# EAGLE schematic evcu_v_0-2 (EAGLE 6.5.0)
DATABASE: ./eVCU_PARTSDB.csv

## Sheet 1 of 9
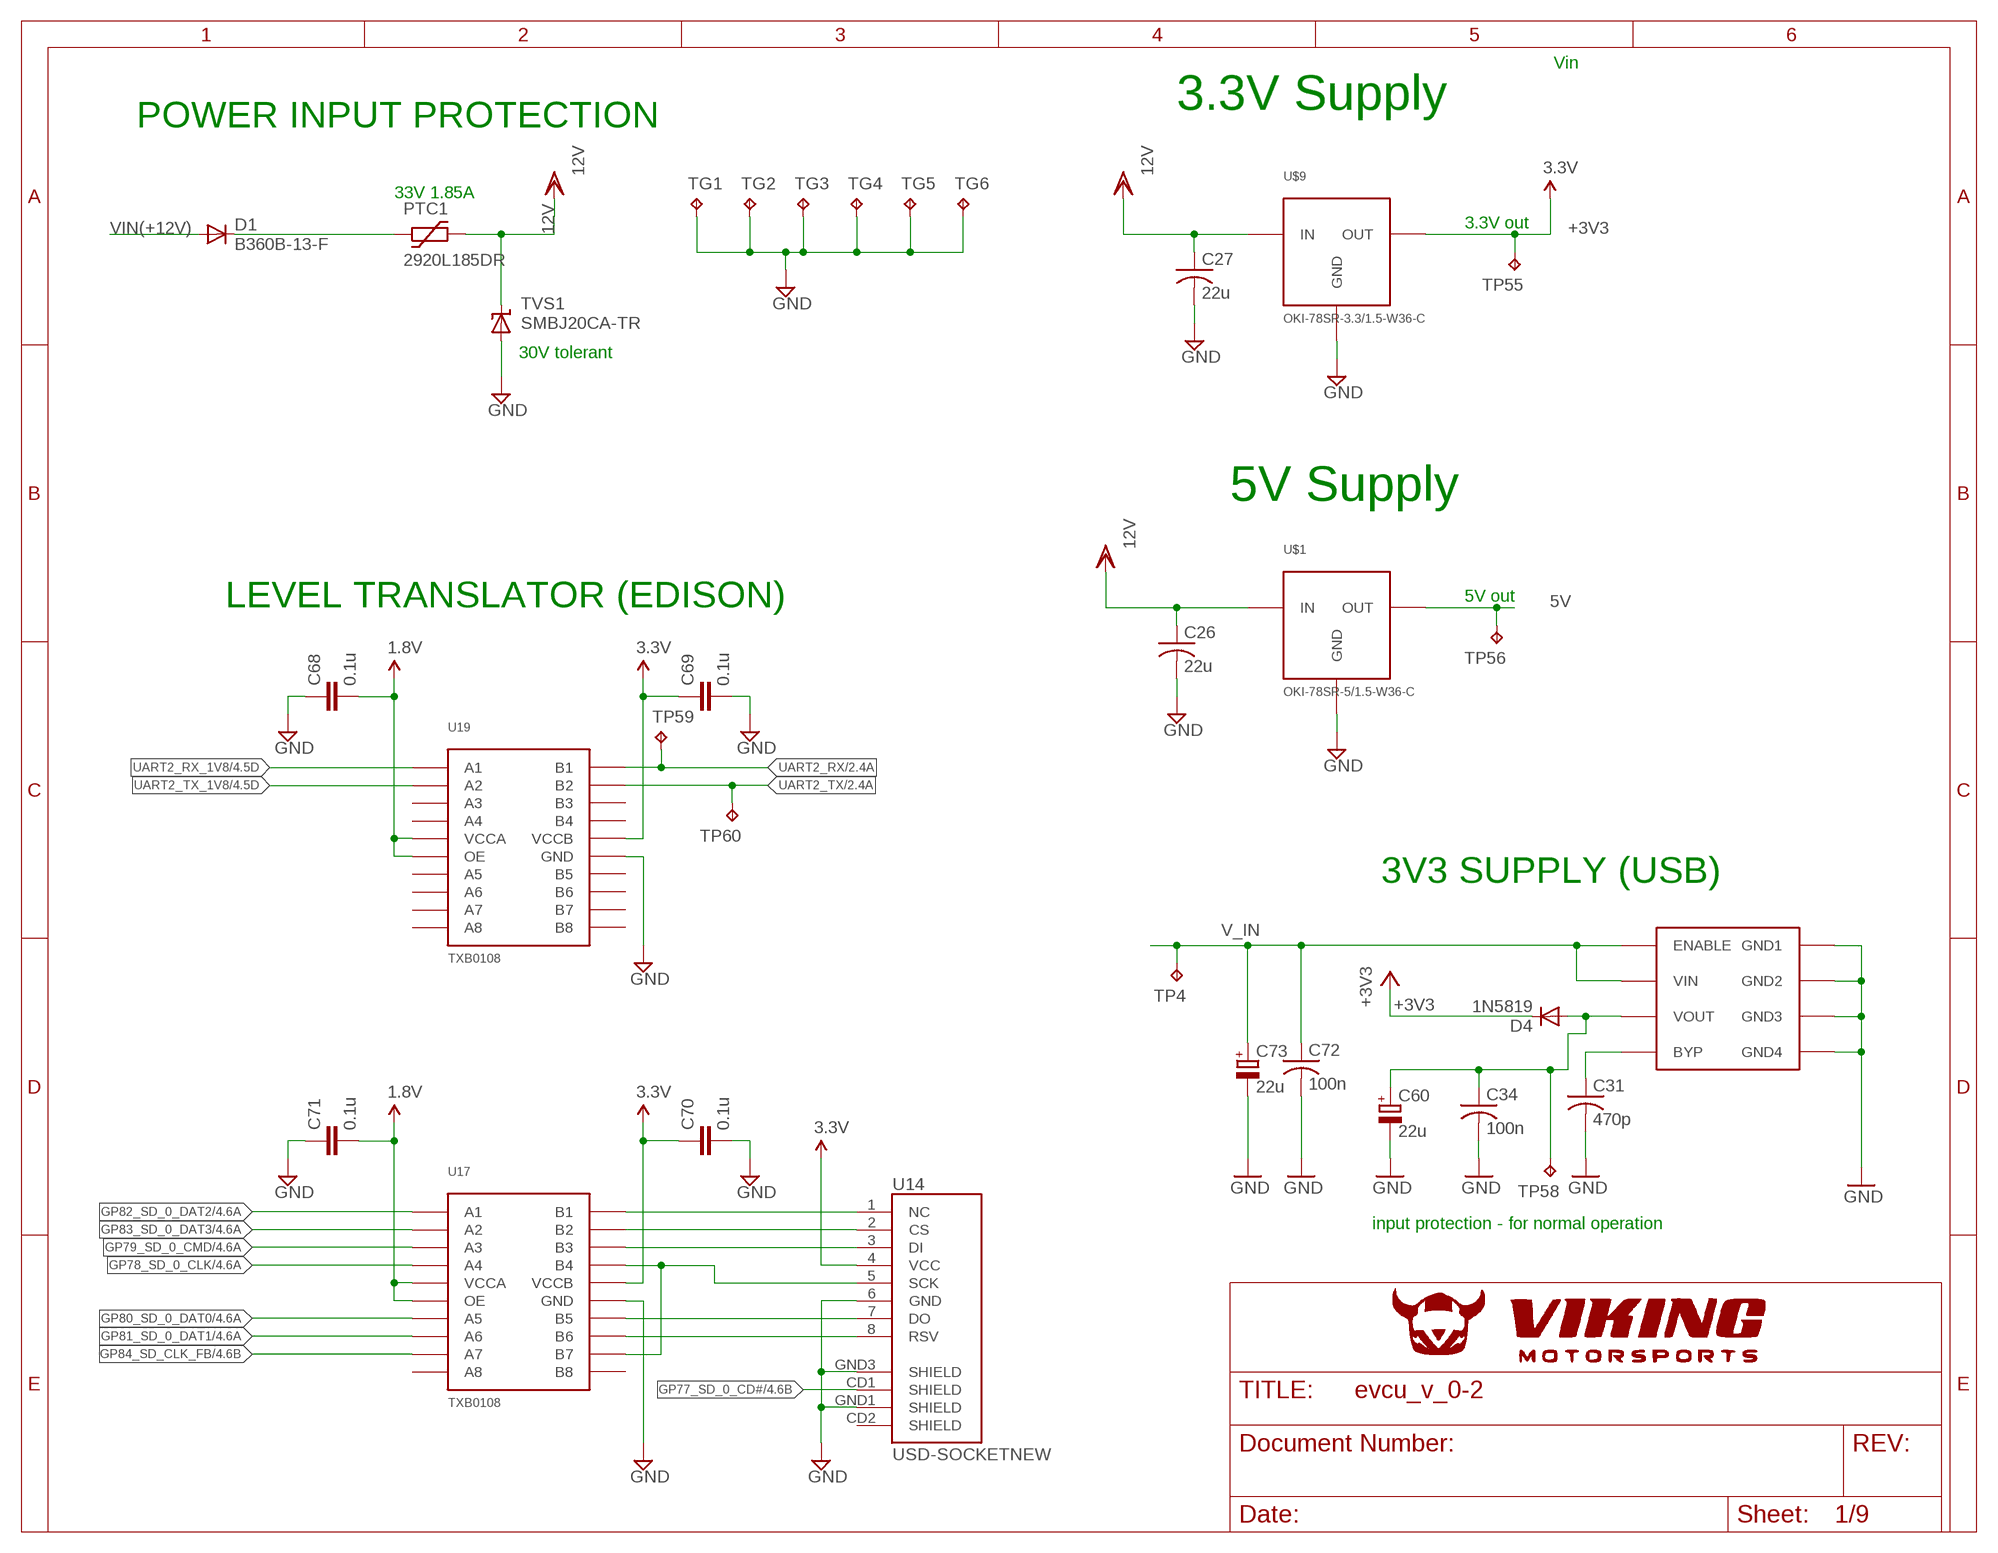
[diagram p0: schematic, sheet 1]

### Parts
C26  22u  C-USC1206  [C1206]
C27  22u  C-USC1206  [C1206]
C31  470p  C-USC0603  [C0603]
C34  100n  C-USC0603  [C0603]
C60  22u  CAPACITOR-POLB  [3528/B]
C68  0.1u  C-EUC0603  [C0603@1]
C69  0.1u  C-EUC0603  [C0603@1]
C70  0.1u  C-EUC0603  [C0603@1]
C71  0.1u  C-EUC0603  [C0603@1]
C72  100n  C-USC0603  [C0603]
C73  22u  CAPACITOR-POLB  [3528/B]
D1  B360B-13-F  DIODE-SMB  [SMB]
D4  1N5819  DIODE-MICROMELF-R  [MICROMELF-R]
PTC1  2920L185DR  2920L  [2920L]
TG1  TPB1,27  [B1,27]
TG2  TPB1,27  [B1,27]
TG3  TPB1,27  [B1,27]
TG4  TPB1,27  [B1,27]
TG5  TPB1,27  [B1,27]
TG6  TPB1,27  [B1,27]
TP4  TPB1,27  [B1,27]
TP55  TPB1,27  [B1,27]
TP56  TPB1,27  [B1,27]
TP58  TPB1,27  [B1,27]
TP59  TPB1,27  [B1,27]
TP60  TPB1,27  [B1,27]
TVS1  SMBJ20CA-TR  SUPPRESSOR-SMBJ  [SMBJ]
U14  USD-SOCKETNEW  [MICRO-SD-SOCKET-PP]
U17  TXB0108  [TSSOP20]
U19  TXB0108  [TSSOP20]
U$1  OKI-78SR-5/1.5-W36-C  [OKI-78SR]
U$9  OKI-78SR-3.3/1.5-W36-C  [OKI-78SR]
VREG1  MIC5209  [SOIC8]

### Nets
5V: TP56.TP U$1.P3(OUT) ; also sheet 3,5,6,7,8,9
12V: C26.1 C27.1 PTC1.P$2 TVS1.C U$1.P1(IN) U$9.P1(IN) ; also sheet 5
+1V8: C68.2 C71.2 U17.2(VCCA) U17.10(OE) U19.2(VCCA) U19.10(OE) ; supply symbol labelled 1.8V ; also sheet 4
+3V3: C69.1 C70.1 D4.C TP55.TP U14.4(VCC) U17.19(VCCB) U19.19(VCCB) U$9.P3(OUT) ; supply symbol labelled 3.3V ; also sheet 2,3,4,5,6
GND: C26.2 C27.2 C31.2 C34.2 C60.- C68.1 C69.2 C70.2 C71.1 C72.2 C73.- TG1.TP TG2.TP TG3.TP TG4.TP TG5.TP TG6.TP TVS1.A U14.6(GND) U14.GND1(SHIELD) U14.GND3(SHIELD) U17.11(GND) U19.11(GND) U$1.P2(GND) U$9.P2(GND) VREG1.5(GND4) VREG1.6(GND3) VREG1.7(GND2) VREG1.8(GND1) ; also sheet 2,3,4,5,6,7,8,9
GP77_SD_0_CD#: U14.CD1(SHIELD) ; also sheet 4
GP78_SD_0_CLK: U17.5(A4) ; also sheet 4
GP79_SD_0_CMD: U17.4(A3) ; also sheet 4
GP80_SD_0_DAT0: U17.6(A5) ; also sheet 4
GP81_SD_0_DAT1: U17.7(A6) ; also sheet 4
GP82_SD_0_DAT2: U17.1(A1) ; also sheet 4
GP83_SD_0_DAT3: U17.3(A2) ; also sheet 4
GP84_SD_CLK_FB: U17.8(A7) ; also sheet 4
N$3: U14.1(NC) U17.20(B1)
N$5: U14.2(CS) U17.18(B2)
N$8: U14.3(DI) U17.17(B3)
N$10: U14.7(DO) U17.15(B5)
N$11: U14.8(RSV) U17.14(B6)
N$12: C31.1 VREG1.4(BYP)
N$14: C34.1 C60.+ D4.A TP58.TP VREG1.3(VOUT)
N$33: D1.C PTC1.P$1
SCK: U14.5(SCK) U17.13(B7) U17.16(B4)
UART2_RX: TP59.TP U19.20(B1) ; also sheet 2
UART2_RX_1V8: U19.1(A1) ; also sheet 4
UART2_TX: TP60.TP U19.18(B2) ; also sheet 2
UART2_TX_1V8: U19.3(A2) ; also sheet 4
V_IN: C72.1 C73.+ TP4.TP VREG1.1(ENABLE) VREG1.2(VIN) ; also sheet 2
VIN(+12V): D1.A ; also sheet 9
Unconnected: U14.CD2(SHIELD) U17.9(A8) U17.12(B8) U19.4(A3) U19.5(A4) U19.6(A5) U19.7(A6) U19.8(A7) U19.9(A8) U19.12(B8) U19.13(B7) U19.14(B6) U19.15(B5) U19.16(B4) U19.17(B3)

### Notes on the sheet
- Vin
- 3.3V Supply
- POWER INPUT PROTECTION
- 33V 1.85A
- 3.3V out
- 30V tolerant
- 5V Supply
- 5V out
- LEVEL TRANSLATOR (EDISON)
- 3V3 SUPPLY (USB)
- input protection - for normal operation

## Sheet 2 of 9
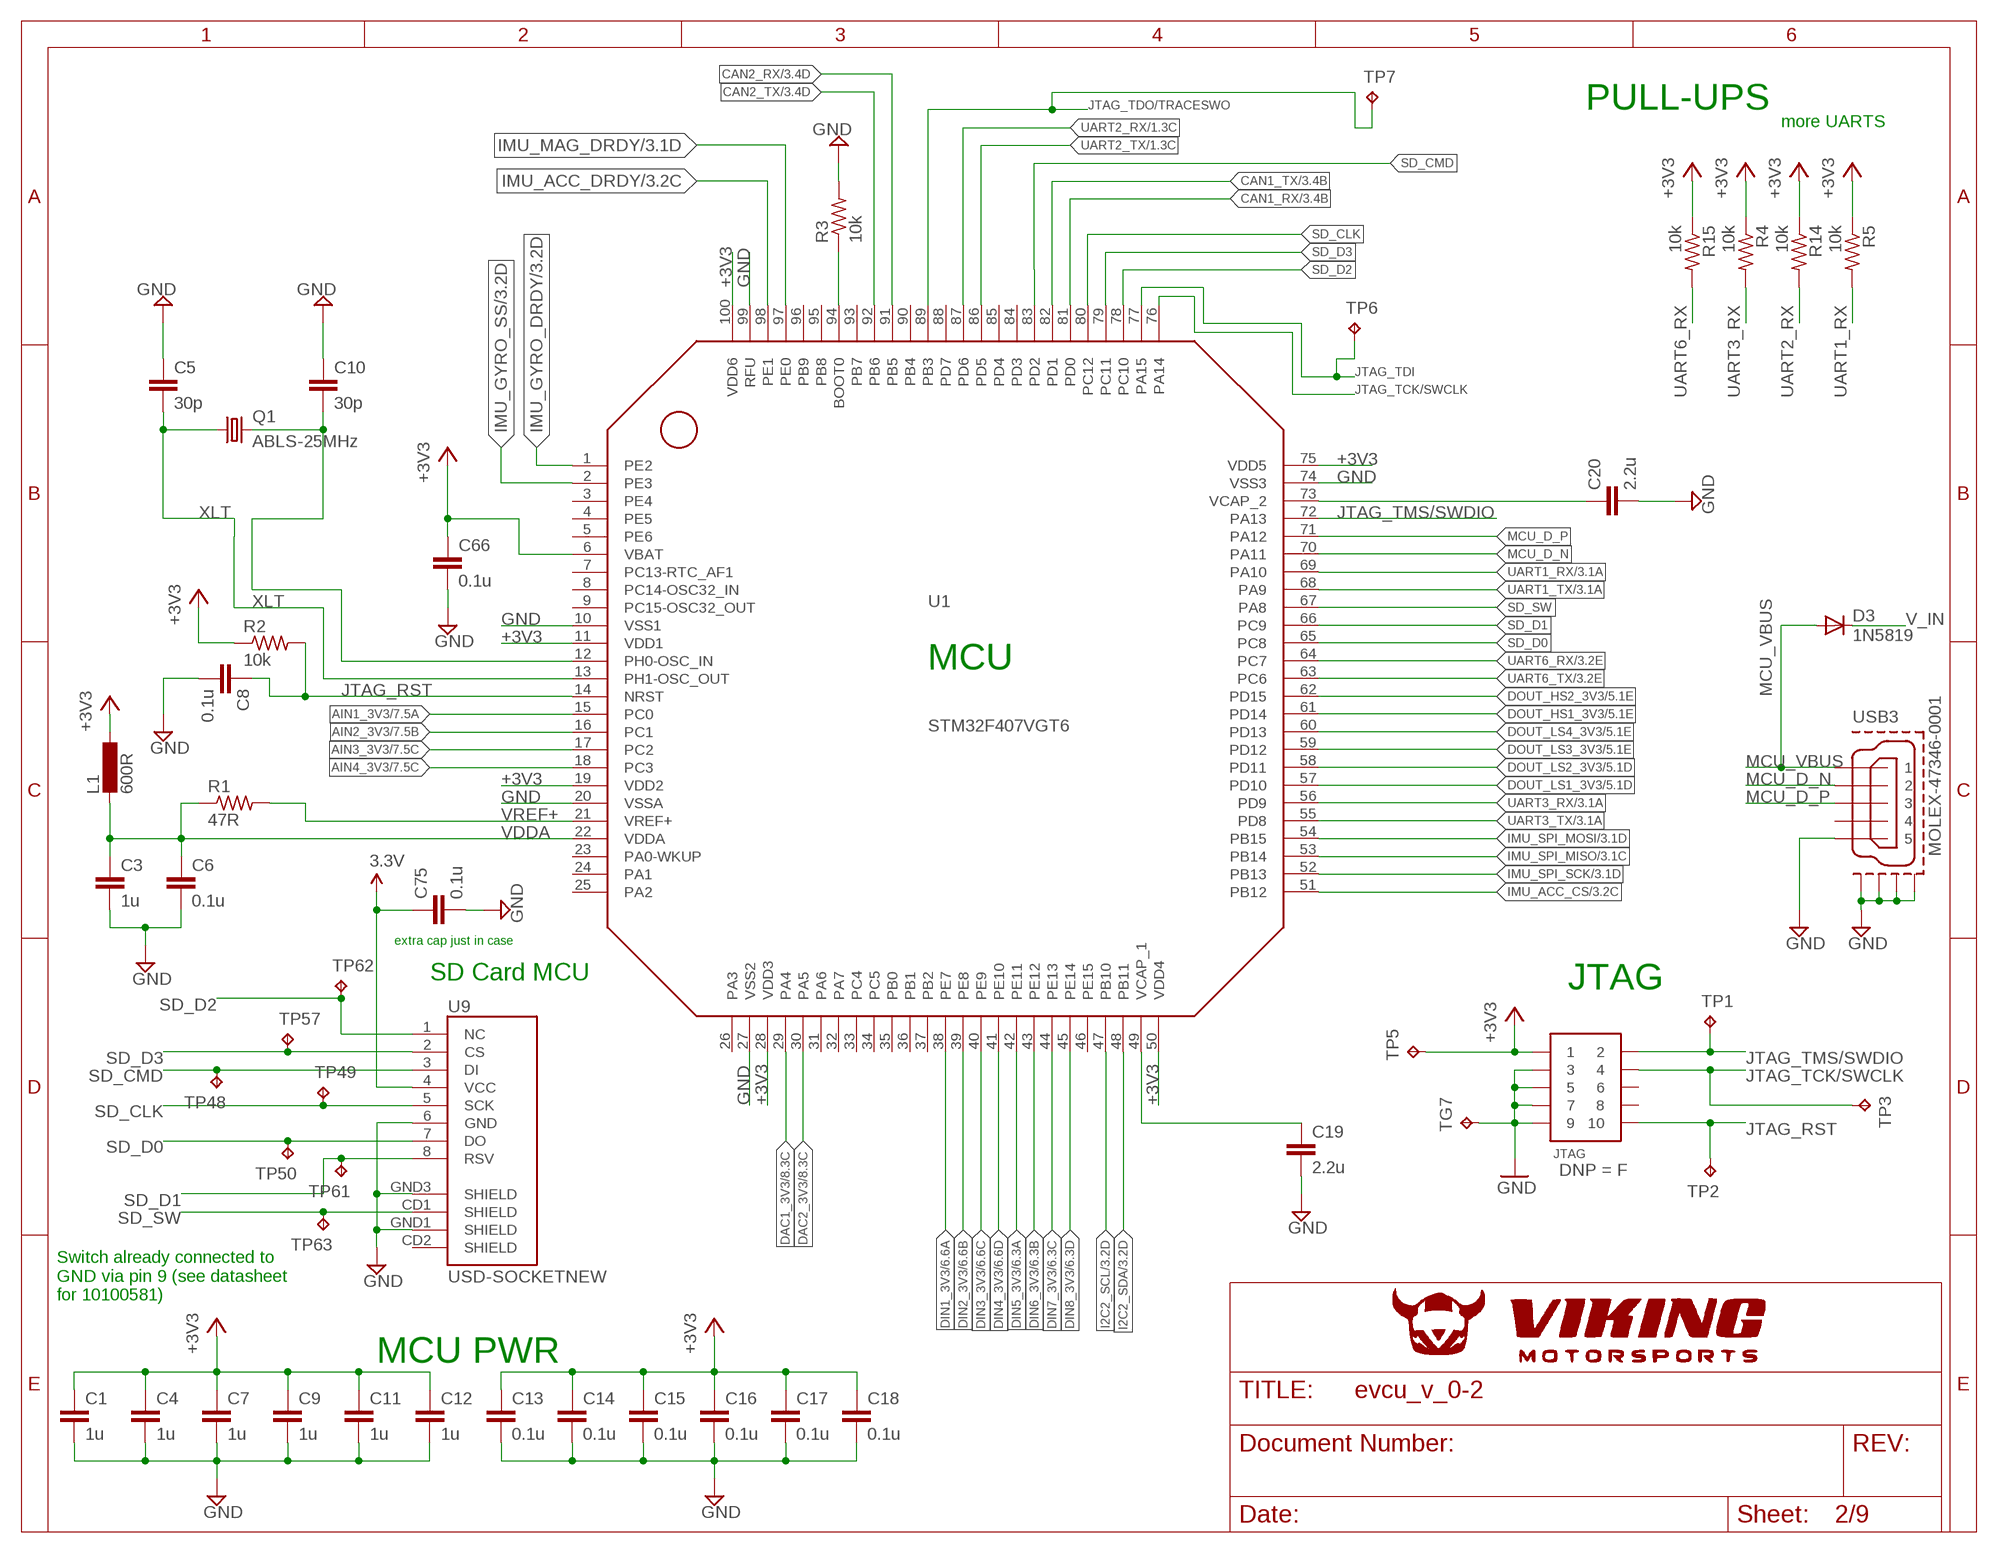
[diagram p1: schematic, sheet 2]

### Parts
C1  1u  C-EUC0603  [C0603@1]
C3  1u  C-EUC0603  [C0603@1]
C4  1u  C-EUC0603  [C0603@1]
C5  30p  C-EUC0603  [C0603@1]
C6  0.1u  C-EUC0603  [C0603@1]
C7  1u  C-EUC0603  [C0603@1]
C8  0.1u  C-EUC0603  [C0603@1]
C9  1u  C-EUC0603  [C0603@1]
C10  30p  C-EUC0603  [C0603@1]
C11  1u  C-EUC0603  [C0603@1]
C12  1u  C-EUC0603  [C0603@1]
C13  0.1u  C-EUC0603  [C0603@1]
C14  0.1u  C-EUC0603  [C0603@1]
C15  0.1u  C-EUC0603  [C0603@1]
C16  0.1u  C-EUC0603  [C0603@1]
C17  0.1u  C-EUC0603  [C0603@1]
C18  0.1u  C-EUC0603  [C0603@1]
C19  2.2u  C-EUC0603  [C0603@1]
C20  2.2u  C-EUC0603  [C0603@1]
C66  0.1u  C-EUC0603  [C0603@1]
C75  0.1u  C-EUC0603  [C0603@1]
D3  1N5819  DIODE-MICROMELF-R  [MICROMELF-R]
JTAG  PIN_HDR_EDG_1.27MM_5-2  CONN_5-2-FTSH-V  [FTSH-105-DV]
L1  600R  INDUCTOR-0603  [0603-IND]
Q1  ABLS-25MHz  CSM-7X-DU  [CSM-7X-DU]
R1  47R  R-US_R0603  [R0603]
R2  10k  R-US_R0603  [R0603]
R3  10k  R-US_R0603  [R0603]
R4  10k  R-US_R0603  [R0603]
R5  10k  R-US_R0603  [R0603]
R14  10k  R-US_R0603  [R0603]
R15  10k  R-US_R0603  [R0603]
TG7  TPB1,27  [B1,27]
TP1  TPB1,27  [B1,27]
TP2  TPB1,27  [B1,27]
TP3  TPB1,27  [B1,27]
TP5  TPB1,27  [B1,27]
TP6  TPB1,27  [B1,27]
TP7  TPB1,27  [B1,27]
TP48  TPB1,27  [B1,27]
TP49  TPB1,27  [B1,27]
TP50  TPB1,27  [B1,27]
TP57  TPB1,27  [B1,27]
TP61  TPB1,27  [B1,27]
TP62  TPB1,27  [B1,27]
TP63  TPB1,27  [B1,27]
U1  STM32F407VGT6  STM32F207VC  [LQFP100]
U9  USD-SOCKETNEW  [MICRO-SD-SOCKET-PP]
USB3  MOLEX-47346-0001  [MOLEX-47364-0001]

### Nets
+3V3: C1.1 C4.1 C7.1 C9.1 C11.1 C12.1 C13.1 C14.1 C15.1 C16.1 C17.1 C18.1 C66.1 C75.1 JTAG.1 L1.P$1 R2.1 R4.1 R5.1 R14.1 R15.1 TP5.TP U1.6(VBAT) U1.11(VDD1) U1.19(VDD2) U1.28(VDD3) U1.50(VDD4) U1.75(VDD5) U1.100(VDD6) U9.4(VCC) ; supply symbol labelled 3.3V ; also sheet 1,3,4,5,6
AIN1_3V3: U1.15(PC0) ; also sheet 7
AIN2_3V3: U1.16(PC1) ; also sheet 7
AIN3_3V3: U1.17(PC2) ; also sheet 7
AIN4_3V3: U1.18(PC3) ; also sheet 7
CAN1_RX: U1.81(PD0) ; also sheet 3
CAN1_TX: U1.82(PD1) ; also sheet 3
CAN2_RX: U1.91(PB5) ; also sheet 3
CAN2_TX: U1.92(PB6) ; also sheet 3
DAC1_3V3: U1.29(PA4) ; also sheet 8
DAC2_3V3: U1.30(PA5) ; also sheet 8
DIN1_3V3: U1.38(PE7) ; also sheet 6
DIN2_3V3: U1.39(PE8) ; also sheet 6
DIN3_3V3: U1.40(PE9) ; also sheet 6
DIN4_3V3: U1.41(PE10) ; also sheet 6
DIN5_3V3: U1.42(PE11) ; also sheet 6
DIN6_3V3: U1.43(PE12) ; also sheet 6
DIN7_3V3: U1.44(PE13) ; also sheet 6
DIN8_3V3: U1.45(PE14) ; also sheet 6
DOUT_HS1_3V3: U1.61(PD14) ; also sheet 5
DOUT_HS2_3V3: U1.62(PD15) ; also sheet 5
DOUT_LS1_3V3: U1.57(PD10) ; also sheet 5
DOUT_LS2_3V3: U1.58(PD11) ; also sheet 5
DOUT_LS3_3V3: U1.59(PD12) ; also sheet 5
DOUT_LS4_3V3: U1.60(PD13) ; also sheet 5
GND: C1.2 C3.2 C4.2 C5.1 C6.2 C7.2 C8.2 C9.2 C10.1 C11.2 C12.2 C13.2 C14.2 C15.2 C16.2 C17.2 C18.2 C19.2 C20.2 C66.2 C75.2 JTAG.3 JTAG.5 JTAG.7 JTAG.9 R3.2 TG7.TP U1.10(VSS1) U1.20(VSSA) U1.27(VSS2) U1.74(VSS3) U1.99(RFU) U9.6(GND) U9.GND1(SHIELD) U9.GND3(SHIELD) USB3.5 USB3.GND1 USB3.GND2 USB3.GND3 USB3.GND4 ; also sheet 1,3,4,5,6,7,8,9
I2C2_SCL: U1.47(PB10) ; also sheet 3
I2C2_SDA: U1.48(PB11) ; also sheet 3
IMU_ACC_CS: U1.51(PB12) ; also sheet 3
IMU_ACC_DRDY: U1.98(PE1) ; also sheet 3
IMU_GYRO_DRDY: U1.1(PE2) ; also sheet 3
IMU_GYRO_SS: U1.2(PE3) ; also sheet 3
IMU_MAG_DRDY: U1.97(PE0) ; also sheet 3
IMU_SPI_MISO: U1.53(PB14) ; also sheet 3
IMU_SPI_MOSI: U1.54(PB15) ; also sheet 3
IMU_SPI_SCK: U1.52(PB13) ; also sheet 3
JTAG_RST: C8.1 JTAG.10 R2.2 TP2.TP U1.14(NRST)
JTAG_TCK/SWCLK: JTAG.4 TP3.TP U1.76(PA14)
JTAG_TDI: TP6.TP U1.77(PA15)
JTAG_TDO/TRACESWO: TP7.TP U1.89(PB3)
JTAG_TMS/SWDIO: JTAG.2 TP1.TP U1.72(PA13)
MCU_D_N: U1.70(PA11) USB3.2
MCU_D_P: U1.71(PA12) USB3.3
MCU_VBUS: D3.A USB3.1
N$1: C19.1 U1.49(VCAP_1)
N$2: C20.1 U1.73(VCAP_2)
N$4: C10.2 Q1.2 U1.12(PH0-OSC_IN)
N$9: R3.1 U1.94(BOOT0)
SD_CLK: TP49.TP U1.80(PC12) U9.5(SCK)
SD_CMD: TP48.TP U1.83(PD2) U9.3(DI)
SD_D0: TP50.TP U1.65(PC8) U9.7(DO)
SD_D1: TP61.TP U1.66(PC9) U9.8(RSV)
SD_D2: TP62.TP U1.78(PC10) U9.1(NC)
SD_D3: TP57.TP U1.79(PC11) U9.2(CS)
SD_SW: TP63.TP U1.67(PA8) U9.CD1(SHIELD)
UART1_RX: R5.2 U1.69(PA10) ; also sheet 3
UART1_TX: U1.68(PA9) ; also sheet 3
UART2_RX: R14.2 U1.87(PD6) ; also sheet 1
UART2_TX: U1.86(PD5) ; also sheet 1
UART3_RX: R4.2 U1.56(PD9) ; also sheet 3
UART3_TX: U1.55(PD8) ; also sheet 3
UART6_RX: R15.2 U1.64(PC7) ; also sheet 3
UART6_TX: U1.63(PC6) ; also sheet 3
V_IN: D3.C ; also sheet 1
VDDA: C3.1 C6.1 L1.P$2 R1.1 U1.22(VDDA)
VREF+: R1.2 U1.21(VREF+)
XLT: C5.2 Q1.1 U1.13(PH1-OSC_OUT)
Unconnected: JTAG.6 JTAG.8 U1.3(PE4) U1.4(PE5) U1.5(PE6) U1.7(PC13-RTC_AF1) U1.8(PC14-OSC32_IN) U1.9(PC15-OSC32_OUT) U1.23(PA0-WKUP) U1.24(PA1) U1.25(PA2) U1.26(PA3) U1.31(PA6) U1.32(PA7) U1.33(PC4) U1.34(PC5) U1.35(PB0) U1.36(PB1) U1.37(PB2) U1.46(PE15) U1.84(PD3) U1.85(PD4) U1.88(PD7) U1.90(PB4) U1.93(PB7) U1.95(PB8) U1.96(PB9) U9.CD2(SHIELD) USB3.4

### Notes on the sheet
- PULL-UPS
- more UARTS
- MCU
- extra cap just in case
- SD Card MCU | JTAG
- Switch already connected to
  GND via pin 9 (see datasheet
  for 10100581)
- MCU PWR

## Sheet 3 of 9
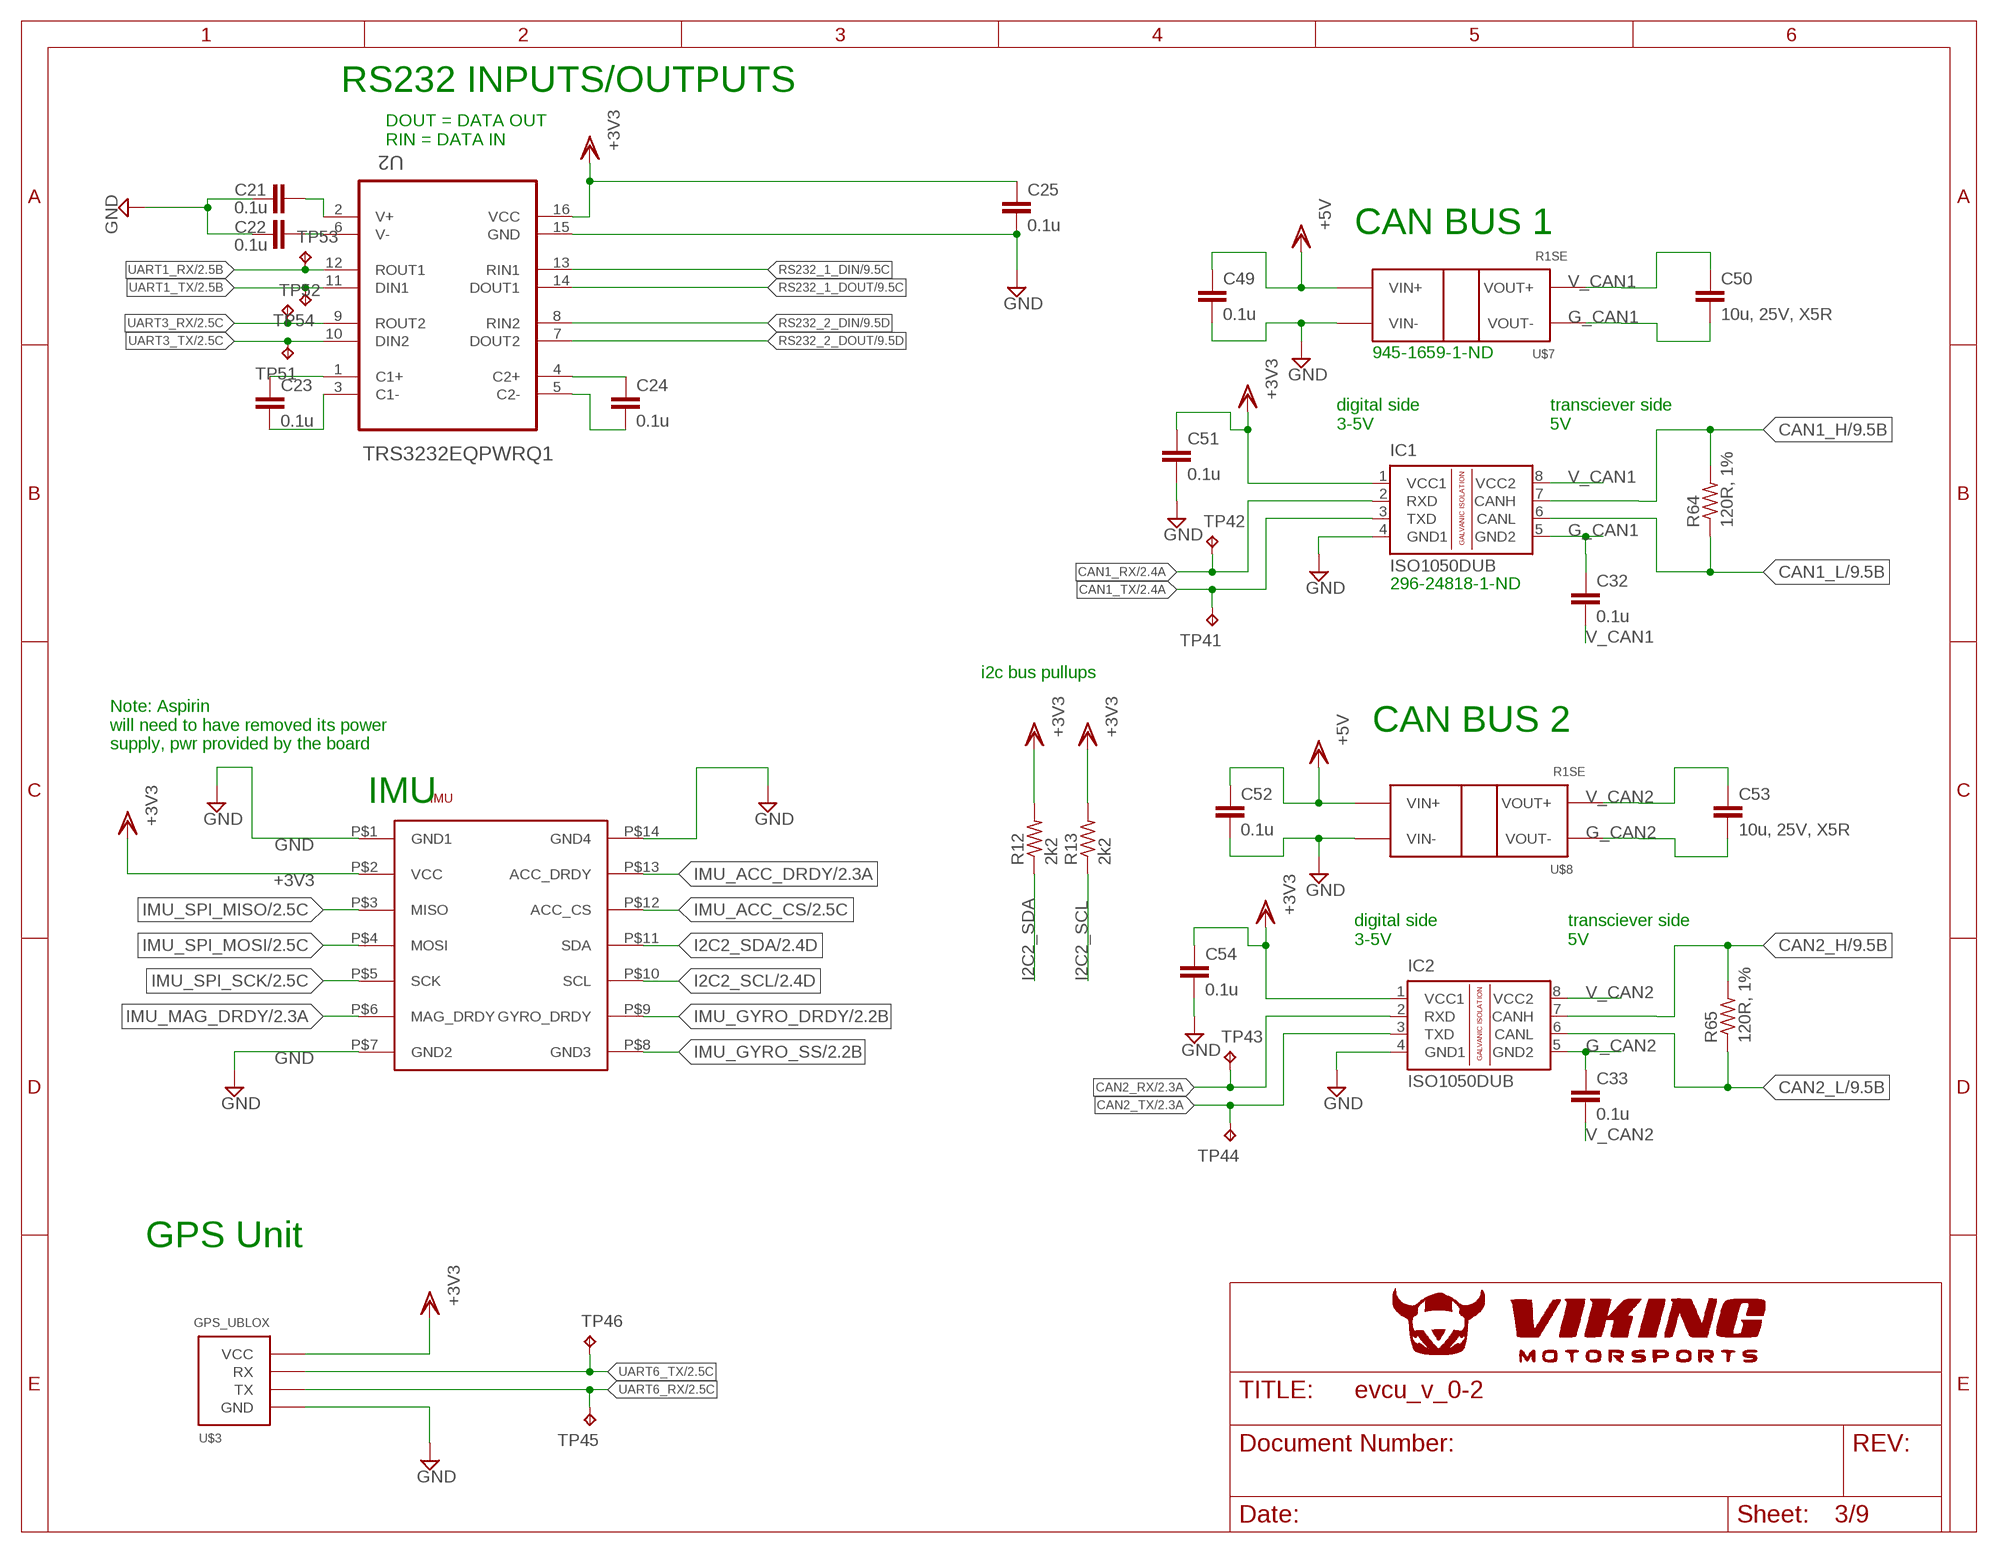
[diagram p2: schematic, sheet 3]

### Parts
C21  0.1u  C-EUC0603  [C0603@1]
C22  0.1u  C-EUC0603  [C0603@1]
C23  0.1u  C-EUC0603  [C0603@1]
C24  0.1u  C-EUC0603  [C0603@1]
C25  0.1u  C-EUC0603  [C0603@1]
C32  0.1u  C-EUC0603  [C0603@1]
C33  0.1u  C-EUC0603  [C0603@1]
C49  0.1u  C-EUC0603  [C0603@1]
C50  10u, 25V, X5R  C-EUC0603  [C0603@1]
C51  0.1u  C-EUC0603  [C0603@1]
C52  0.1u  C-EUC0603  [C0603@1]
C53  10u, 25V, X5R  C-EUC0603  [C0603@1]
C54  0.1u  C-EUC0603  [C0603@1]
IC1  ISO1050DUB  [DUB-R-PDSO-G8]
IC2  ISO1050DUB  [DUB-R-PDSO-G8]
IMU  ASPIRIN  [ASPIRIN_1]
R12  2k2  R-US_R0603  [R0603]
R13  2k2  R-US_R0603  [R0603]
R64  120R, 1%  R-US_R0603  [R0603]
R65  120R, 1%  R-US_R0603  [R0603]
TP41  TPB1,27  [B1,27]
TP42  TPB1,27  [B1,27]
TP43  TPB1,27  [B1,27]
TP44  TPB1,27  [B1,27]
TP45  TPB1,27  [B1,27]
TP46  TPB1,27  [B1,27]
TP51  TPB1,27  [B1,27]
TP52  TPB1,27  [B1,27]
TP53  TPB1,27  [B1,27]
TP54  TPB1,27  [B1,27]
U2  TRS3232EQPWRQ1  [SOP65P640X120-16N]
U$3  GPS_UBLOX  [GPS_UBLOX]
U$7  R1SE  [R1SE]
U$8  R1SE  [R1SE]

### Nets
5V: C49.1 C52.1 U$7.P2(VIN+) U$8.P2(VIN+) ; supply symbol labelled +5V ; also sheet 1,5,6,7,8,9
+3V3: C25.1 C51.1 C54.1 IC1.1(VCC1) IC2.1(VCC1) IMU.P$2(VCC) R12.2 R13.2 U2.16(VCC) U$3.VCC ; also sheet 1,2,4,5,6
CAN1_H: IC1.7(CANH) R64.2 ; also sheet 9
CAN1_L: IC1.6(CANL) R64.1 ; also sheet 9
CAN1_RX: IC1.2(RXD) TP42.TP ; also sheet 2
CAN1_TX: IC1.3(TXD) TP41.TP ; also sheet 2
CAN2_H: IC2.7(CANH) R65.2 ; also sheet 9
CAN2_L: IC2.6(CANL) R65.1 ; also sheet 9
CAN2_RX: IC2.2(RXD) TP43.TP ; also sheet 2
CAN2_TX: IC2.3(TXD) TP44.TP ; also sheet 2
G_CAN1: C32.1 C50.2 IC1.5(GND2) U$7.P4(VOUT-)
G_CAN2: C33.1 C53.2 IC2.5(GND2) U$8.P4(VOUT-)
GND: C21.1 C22.1 C25.2 C49.2 C51.2 C52.2 C54.2 IC1.4(GND1) IC2.4(GND1) IMU.P$1(GND1) IMU.P$7(GND2) IMU.P$14(GND4) U2.15(GND) U$3.GND U$7.P1(VIN-) U$8.P1(VIN-) ; also sheet 1,2,4,5,6,7,8,9
I2C2_SCL: IMU.P$10(SCL) R13.1 ; also sheet 2
I2C2_SDA: IMU.P$11(SDA) R12.1 ; also sheet 2
IMU_ACC_CS: IMU.P$12(ACC_CS) ; also sheet 2
IMU_ACC_DRDY: IMU.P$13(ACC_DRDY) ; also sheet 2
IMU_GYRO_DRDY: IMU.P$9(GYRO_DRDY) ; also sheet 2
IMU_GYRO_SS: IMU.P$8(GND3) ; also sheet 2
IMU_MAG_DRDY: IMU.P$6(MAG_DRDY) ; also sheet 2
IMU_SPI_MISO: IMU.P$3(MISO) ; also sheet 2
IMU_SPI_MOSI: IMU.P$4(MOSI) ; also sheet 2
IMU_SPI_SCK: IMU.P$5(SCK) ; also sheet 2
N$6: C24.1 U2.4(C2+)
N$30: C24.2 U2.5(C2-)
N$35: C23.1 U2.1(C1+)
N$36: C23.2 U2.3(C1-)
N$37: C21.2 U2.2(V+)
N$38: C22.2 U2.6(V-)
RS232_1_DIN: U2.13(RIN1) ; also sheet 9
RS232_1_DOUT: U2.14(DOUT1) ; also sheet 9
RS232_2_DIN: U2.8(RIN2) ; also sheet 9
RS232_2_DOUT: U2.7(DOUT2) ; also sheet 9
UART1_RX: TP53.TP U2.12(ROUT1) ; also sheet 2
UART1_TX: TP54.TP U2.11(DIN1) ; also sheet 2
UART3_RX: TP52.TP U2.9(ROUT2) ; also sheet 2
UART3_TX: TP51.TP U2.10(DIN2) ; also sheet 2
UART6_RX: TP45.TP U$3.TX ; also sheet 2
UART6_TX: TP46.TP U$3.RX ; also sheet 2
V_CAN1: C32.2 C50.1 IC1.8(VCC2) U$7.P5(VOUT+)
V_CAN2: C33.2 C53.1 IC2.8(VCC2) U$8.P5(VOUT+)

### Notes on the sheet
- RS232 INPUTS/OUTPUTS
- DOUT = DATA OUT
  RIN = DATA IN
- CAN BUS 1
- 945-1659-1-ND
- digital side
  3-5V
- transciever side
  5V
- 296-24818-1-ND
- i2c bus pullups
- CAN BUS 2
- Note: Aspirin
  will need to have removed its power
  supply, pwr provided by the board
- IMU
- digital side
  3-5V
- transciever side
  5V
- GPS Unit

## Sheet 4 of 9
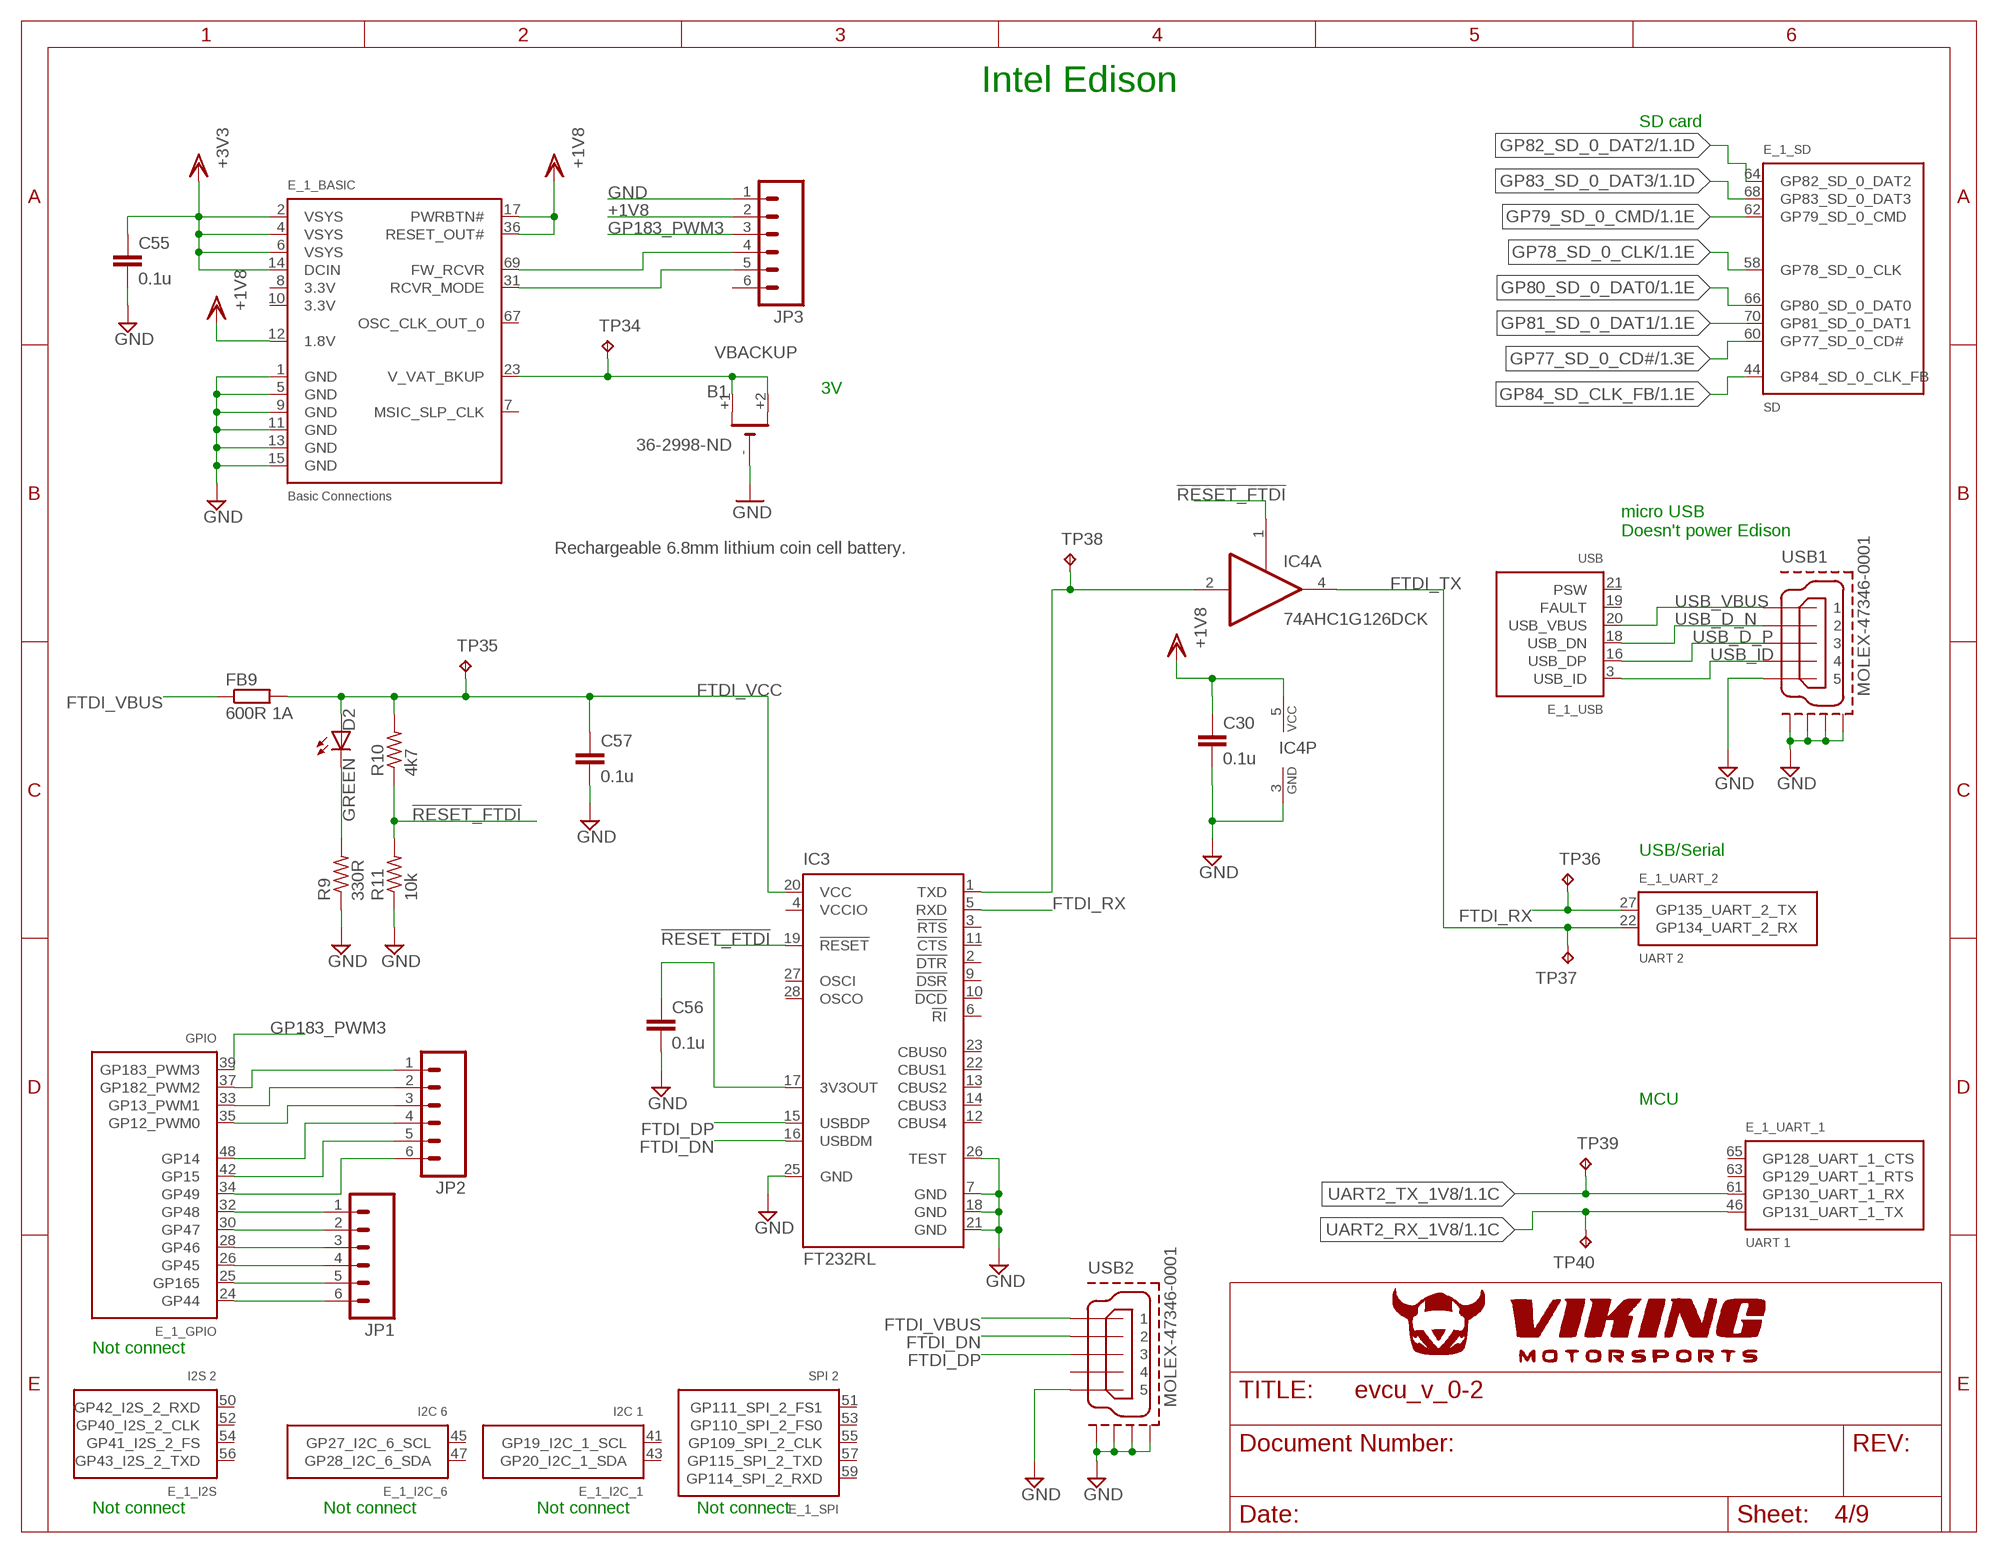
[diagram p3: schematic, sheet 4]

### Parts
B1  36-2998-ND  COIN_CELL_6.8MM  [BATTERY_6.8MM-2998]
C30  0.1u  C-EUC0603  [C0603@1]
C55  0.1u  C-EUC0603  [C0603@1]
C56  0.1u  C-EUC0603  [C0603@1]
C57  0.1u  C-EUC0603  [C0603@1]
D2  GREEN  LED0603  [D0603]
E_1  EDISON_CONNECTOR_SEGMENTED  [EDISON_DAUGHTER]
FB9  600R 1A  FB0603  [C0603]
IC3  FT232RL  [SSOP28]
IC4  74AHC1G126DCK  [SC70-5]
JP1  M06SIP  [1X06]
JP2  M06SIP  [1X06]
JP3  M06SIP  [1X06]
R9  330R  R-US_R0603  [R0603]
R10  4k7  R-US_R0603  [R0603]
R11  10k  R-US_R0603  [R0603]
TP34  TPB1,27  [B1,27]
TP35  TPB1,27  [B1,27]
TP36  TPB1,27  [B1,27]
TP37  TPB1,27  [B1,27]
TP38  TPB1,27  [B1,27]
TP39  TPB1,27  [B1,27]
TP40  TPB1,27  [B1,27]
USB1  MOLEX-47346-0001  [MOLEX-47364-0001]
USB2  MOLEX-47346-0001  [MOLEX-47364-0001]

### Nets
!RESET_FTDI: IC3.19(!RESET) IC4.1(A:OE) R10.1 R11.2
+1V8: C30.1 E_1.12(_BASIC:1.8V) E_1.17(_BASIC:PWRBTN#) E_1.36(_BASIC:RESET_OUT#) IC4.5(P:VCC) JP3.2 ; also sheet 1
+3V3: C55.1 E_1.2(_BASIC:VSYS) E_1.4(_BASIC:VSYS) E_1.6(_BASIC:VSYS) E_1.14(_BASIC:DCIN) ; also sheet 1,2,3,5,6
FTDI_DN: IC3.16(USBDM) USB2.2
FTDI_DP: IC3.15(USBDP) USB2.3
FTDI_RX: E_1.27(_UART_2:GP135_UART_2_TX) IC3.5(RXD) TP36.TP
FTDI_TX: E_1.22(_UART_2:GP134_UART_2_RX) IC4.4(A:O) TP37.TP
FTDI_VBUS: FB9.1 USB2.1
FTDI_VCC: C57.1 D2.A FB9.2 IC3.20(VCC) R10.2 TP35.TP
FW_RCVR: E_1.69(_BASIC:FW_RCVR) JP3.4
GND: B1.- C30.2 C55.2 C56.2 C57.2 E_1.1(_BASIC:GND) E_1.5(_BASIC:GND) E_1.9(_BASIC:GND) E_1.11(_BASIC:GND) E_1.13(_BASIC:GND) E_1.15(_BASIC:GND) IC3.7(GND) IC3.18(GND) IC3.21(GND) IC3.25(GND) IC3.26(TEST) IC4.3(P:GND) JP3.1 R9.1 R11.1 USB1.5 USB1.GND1 USB1.GND2 USB1.GND3 USB1.GND4 USB2.5 USB2.GND1 USB2.GND2 USB2.GND3 USB2.GND4 ; also sheet 1,2,3,5,6,7,8,9
GP12: E_1.35(_GPIO:GP12_PWM0) JP2.3
GP13: E_1.33(_GPIO:GP13_PWM1) JP2.2
GP14: E_1.48(_GPIO:GP14) JP2.4
GP15: E_1.42(_GPIO:GP15) JP2.5
GP44: E_1.24(_GPIO:GP44) JP1.6
GP45: E_1.26(_GPIO:GP45) JP1.4
GP46: E_1.28(_GPIO:GP46) JP1.3
GP47: E_1.30(_GPIO:GP47) JP1.2
GP48: E_1.32(_GPIO:GP48) JP1.1
GP49: E_1.34(_GPIO:GP49) JP2.6
GP77_SD_0_CD#: E_1.60(_SD:GP77_SD_0_CD#) ; also sheet 1
GP78_SD_0_CLK: E_1.58(_SD:GP78_SD_0_CLK) ; also sheet 1
GP79_SD_0_CMD: E_1.62(_SD:GP79_SD_0_CMD) ; also sheet 1
GP80_SD_0_DAT0: E_1.66(_SD:GP80_SD_0_DAT0) ; also sheet 1
GP81_SD_0_DAT1: E_1.70(_SD:GP81_SD_0_DAT1) ; also sheet 1
GP82_SD_0_DAT2: E_1.64(_SD:GP82_SD_0_DAT2) ; also sheet 1
GP83_SD_0_DAT3: E_1.68(_SD:GP83_SD_0_DAT3) ; also sheet 1
GP84_SD_CLK_FB: E_1.44(_SD:GP84_SD_0_CLK_FB) ; also sheet 1
GP165: E_1.25(_GPIO:GP165) JP1.5
GP182: E_1.37(_GPIO:GP182_PWM2) JP2.1
GP183_PWM3: E_1.39(_GPIO:GP183_PWM3) JP3.3
LED1_PWR: D2.C R9.2
N$62: C56.1 IC3.17(3V3OUT)
N$65: IC3.1(TXD) IC4.2(A:I) TP38.TP
RCVR_MODE: E_1.31(_BASIC:RCVR_MODE) JP3.5
UART2_RX_1V8: E_1.46(_UART_1:GP131_UART_1_TX) TP40.TP ; also sheet 1
UART2_TX_1V8: E_1.61(_UART_1:GP130_UART_1_RX) TP39.TP ; also sheet 1
USB_D_N: E_1.18(_USB:USB_DN) USB1.2
USB_D_P: E_1.16(_USB:USB_DP) USB1.3
USB_ID: E_1.3(_USB:USB_ID) USB1.4
USB_VBUS: E_1.20(_USB:USB_VBUS) USB1.1
VBACKUP: B1.+1 B1.+2 E_1.23(_BASIC:V_VAT_BKUP) TP34.TP
Unconnected: E_1.7(_BASIC:MSIC_SLP_CLK) E_1.8(_BASIC:3.3V) E_1.10(_BASIC:3.3V) E_1.19(_USB:FAULT) E_1.21(_USB:PSW) E_1.41(_I2C_1:GP19_I2C_1_SCL) E_1.43(_I2C_1:GP20_I2C_1_SDA) E_1.45(_I2C_6:GP27_I2C_6_SCL) E_1.47(_I2C_6:GP28_I2C_6_SDA) E_1.50(_I2S:GP42_I2S_2_RXD) E_1.51(_SPI:GP111_SPI_2_FS1) E_1.52(_I2S:GP40_I2S_2_CLK) E_1.53(_SPI:GP110_SPI_2_FS0) E_1.54(_I2S:GP41_I2S_2_FS) E_1.55(_SPI:GP109_SPI_2_CLK) E_1.56(_I2S:GP43_I2S_2_TXD) E_1.57(_SPI:GP115_SPI_2_TXD) E_1.59(_SPI:GP114_SPI_2_RXD) E_1.63(_UART_1:GP129_UART_1_RTS) E_1.65(_UART_1:GP128_UART_1_CTS) E_1.67(_BASIC:OSC_CLK_OUT_0) IC3.2(!DTR) IC3.3(!RTS) IC3.6(!RI) IC3.9(!DSR) IC3.10(!DCD) IC3.11(!CTS) IC3.12(CBUS4) IC3.13(CBUS2) IC3.14(CBUS3) IC3.22(CBUS1) IC3.23(CBUS0) IC3.27(OSCI) IC3.28(OSCO) JP3.6 USB2.4

### Notes on the sheet
- Intel Edison
- SD card
- 3V
- micro USB
  Doesn't power Edison
- Rechargeable 6.8mm lithium coin cell battery.
- USB/Serial
- MCU
- Not connect
- Not connect | Not connect | Not connect | Not connect

## Sheet 5 of 9
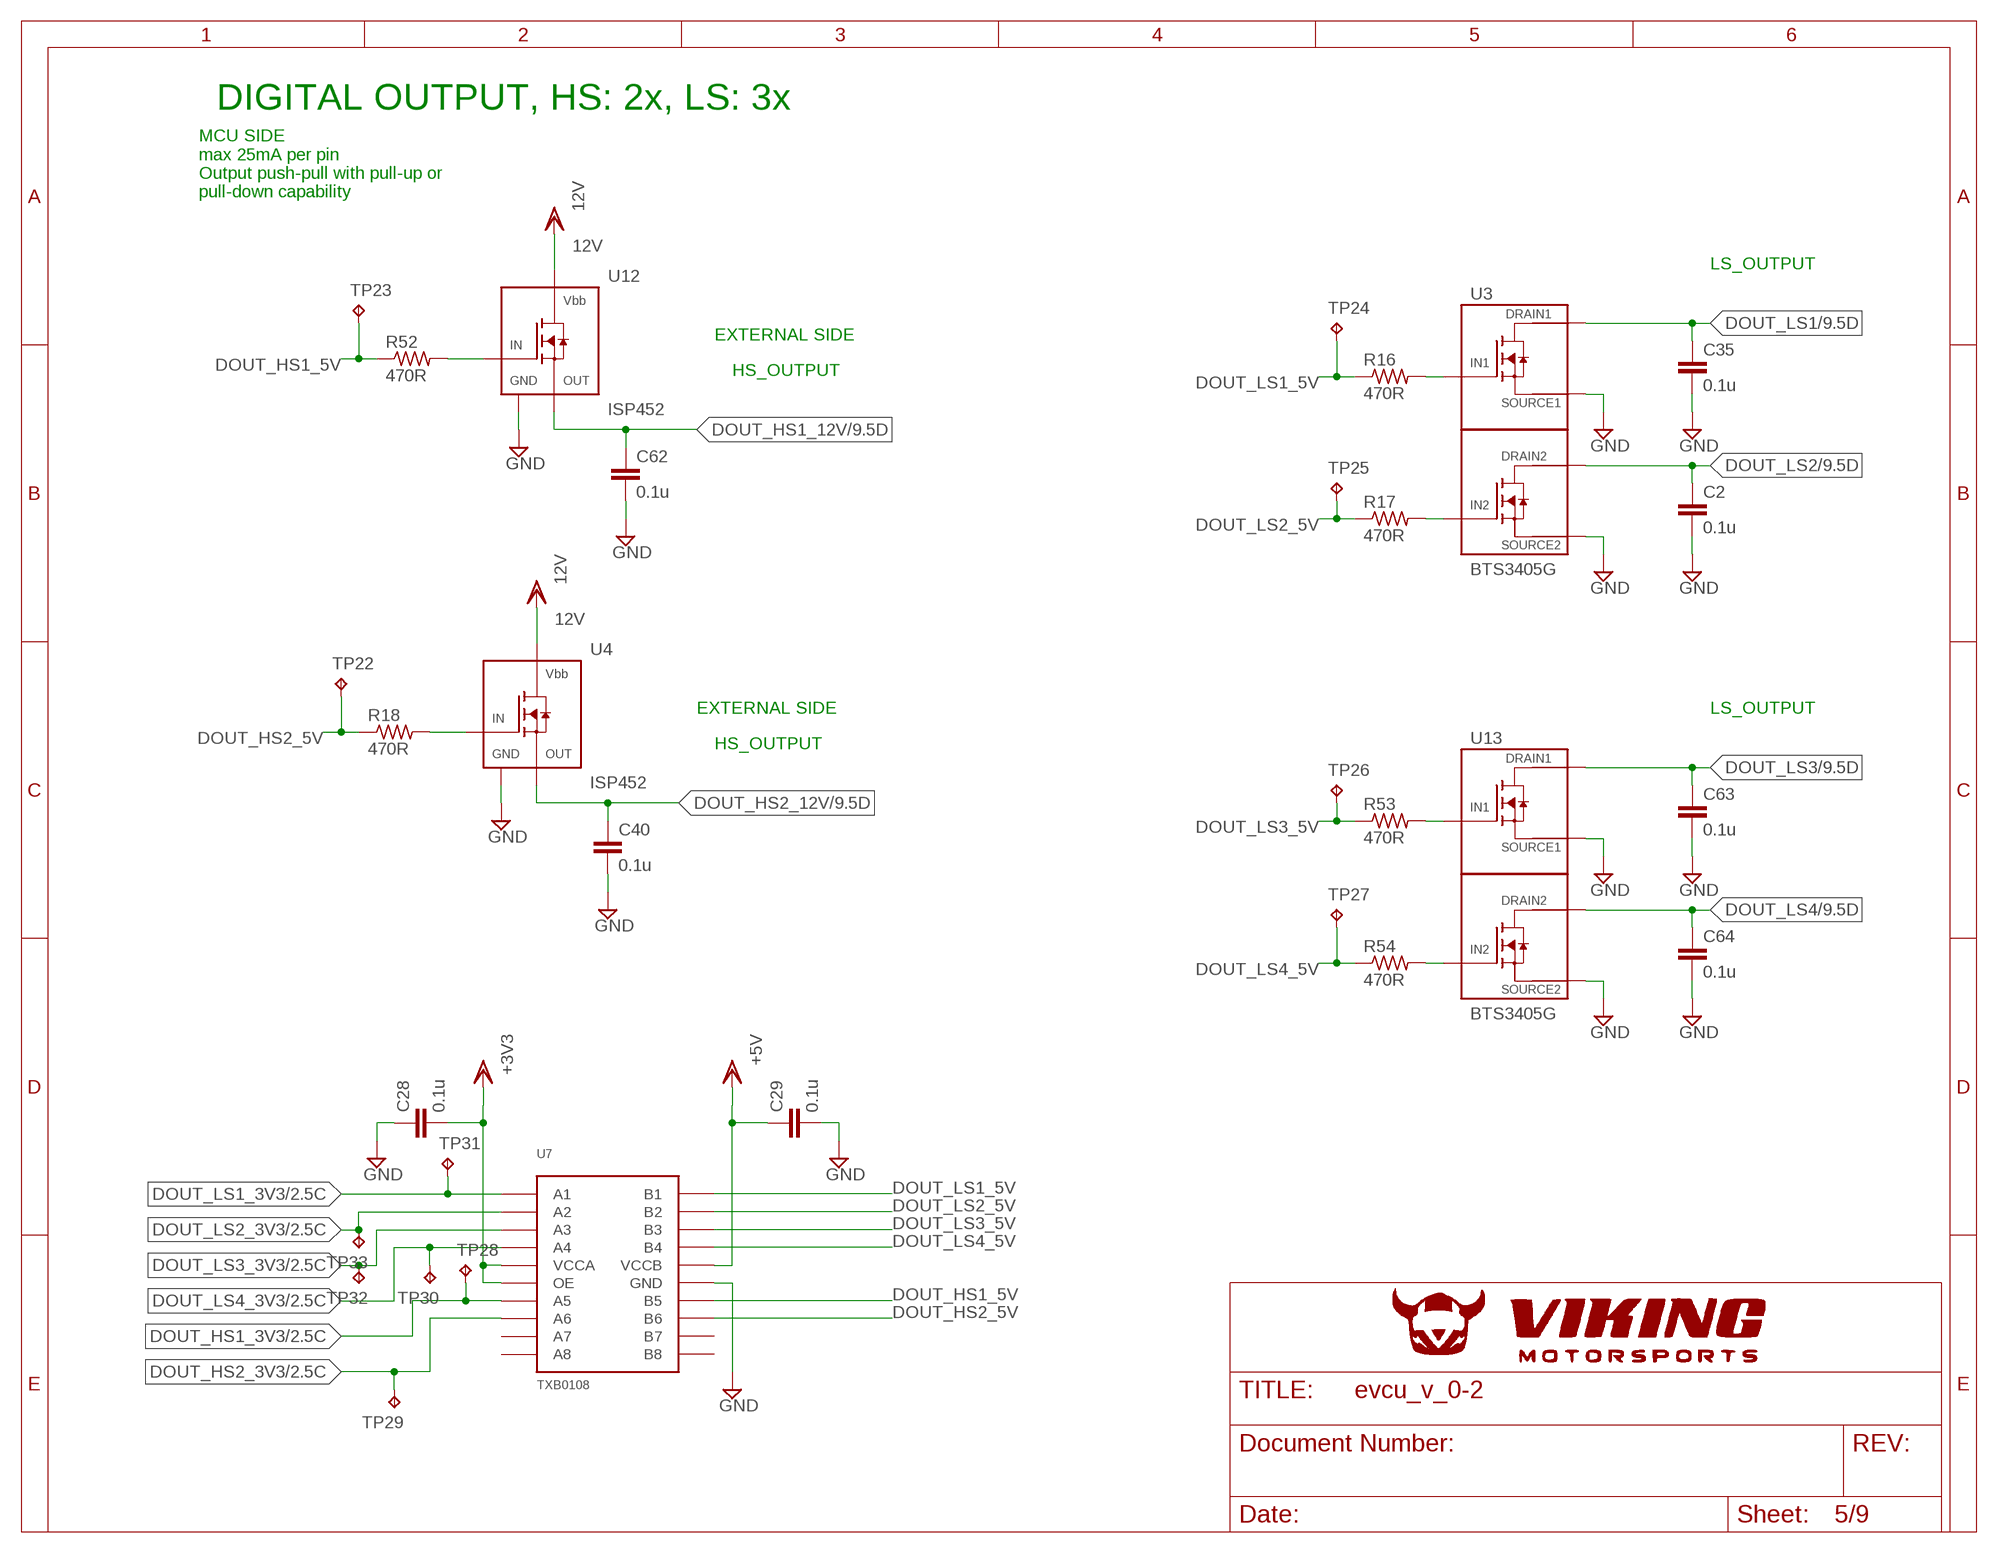
[diagram p4: schematic, sheet 5]

### Parts
C2  0.1u  C-EUC0603  [C0603@1]
C28  0.1u  C-EUC0603  [C0603@1]
C29  0.1u  C-EUC0603  [C0603@1]
C35  0.1u  C-EUC0603  [C0603@1]
C40  0.1u  C-EUC0603  [C0603@1]
C62  0.1u  C-EUC0603  [C0603@1]
C63  0.1u  C-EUC0603  [C0603@1]
C64  0.1u  C-EUC0603  [C0603@1]
R16  470R  R-US_R0603  [R0603]
R17  470R  R-US_R0603  [R0603]
R18  470R  R-US_R0603  [R0603]
R52  470R  R-US_R0603  [R0603]
R53  470R  R-US_R0603  [R0603]
R54  470R  R-US_R0603  [R0603]
TP22  TPB1,27  [B1,27]
TP23  TPB1,27  [B1,27]
TP24  TPB1,27  [B1,27]
TP25  TPB1,27  [B1,27]
TP26  TPB1,27  [B1,27]
TP27  TPB1,27  [B1,27]
TP28  TPB1,27  [B1,27]
TP29  TPB1,27  [B1,27]
TP30  TPB1,27  [B1,27]
TP31  TPB1,27  [B1,27]
TP32  TPB1,27  [B1,27]
TP33  TPB1,27  [B1,27]
U3  BTS3405G  [SOIC8]
U4  ISP452  [SOT223-W]
U7  TXB0108  [TSSOP20]
U12  ISP452  [SOT223-W]
U13  BTS3405G  [SOIC8]

### Nets
5V: C29.1 U7.19(VCCB) ; supply symbol labelled +5V ; also sheet 1,3,6,7,8,9
12V: U4.4(VBB) U12.4(VBB) ; also sheet 1
+3V3: C28.2 U7.2(VCCA) U7.10(OE) ; also sheet 1,2,3,4,6
DOUT_HS1_3V3: TP28.TP U7.6(A5) ; also sheet 2
DOUT_HS1_5V: R52.1 TP23.TP U7.15(B5)
DOUT_HS1_12V: C62.1 U12.1(OUT) ; also sheet 9
DOUT_HS2_3V3: TP29.TP U7.7(A6) ; also sheet 2
DOUT_HS2_5V: R18.1 TP22.TP U7.14(B6)
DOUT_HS2_12V: C40.1 U4.1(OUT) ; also sheet 9
DOUT_LS1: C35.1 U3.7(DRAIN1) U3.8(DRAIN1) ; also sheet 9
DOUT_LS1_3V3: TP31.TP U7.1(A1) ; also sheet 2
DOUT_LS1_5V: R16.1 TP24.TP U7.20(B1)
DOUT_LS2: C2.1 U3.5(DRAIN2) U3.6(DRAIN2) ; also sheet 9
DOUT_LS2_3V3: TP33.TP U7.3(A2) ; also sheet 2
DOUT_LS2_5V: R17.1 TP25.TP U7.18(B2)
DOUT_LS3: C63.1 U13.7(DRAIN1) U13.8(DRAIN1) ; also sheet 9
DOUT_LS3_3V3: TP32.TP U7.4(A3) ; also sheet 2
DOUT_LS3_5V: R53.1 TP26.TP U7.17(B3)
DOUT_LS4: C64.1 U13.5(DRAIN2) U13.6(DRAIN2) ; also sheet 9
DOUT_LS4_3V3: TP30.TP U7.5(A4) ; also sheet 2
DOUT_LS4_5V: R54.1 TP27.TP U7.16(B4)
GND: C2.2 C28.1 C29.2 C35.2 C40.2 C62.2 C63.2 C64.2 U3.1(SOURCE1) U3.3(SOURCE2) U4.2(GND) U7.11(GND) U12.2(GND) U13.1(SOURCE1) U13.3(SOURCE2) ; also sheet 1,2,3,4,6,7,8,9
N$7: R16.2 U3.2(IN1)
N$16: R17.2 U3.4(IN2)
N$23: R18.2 U4.3(IN)
N$68: R52.2 U12.3(IN)
N$69: R53.2 U13.2(IN1)
N$70: R54.2 U13.4(IN2)
Unconnected: U7.8(A7) U7.9(A8) U7.12(B8) U7.13(B7)

### Notes on the sheet
- DIGITAL OUTPUT, HS: 2x, LS: 3x
- MCU SIDE
  max 25mA per pin
  Output push-pull with pull-up or
  pull-down capability
- LS_OUTPUT
- EXTERNAL SIDE
- HS_OUTPUT
- EXTERNAL SIDE | LS_OUTPUT
- HS_OUTPUT

## Sheet 6 of 9
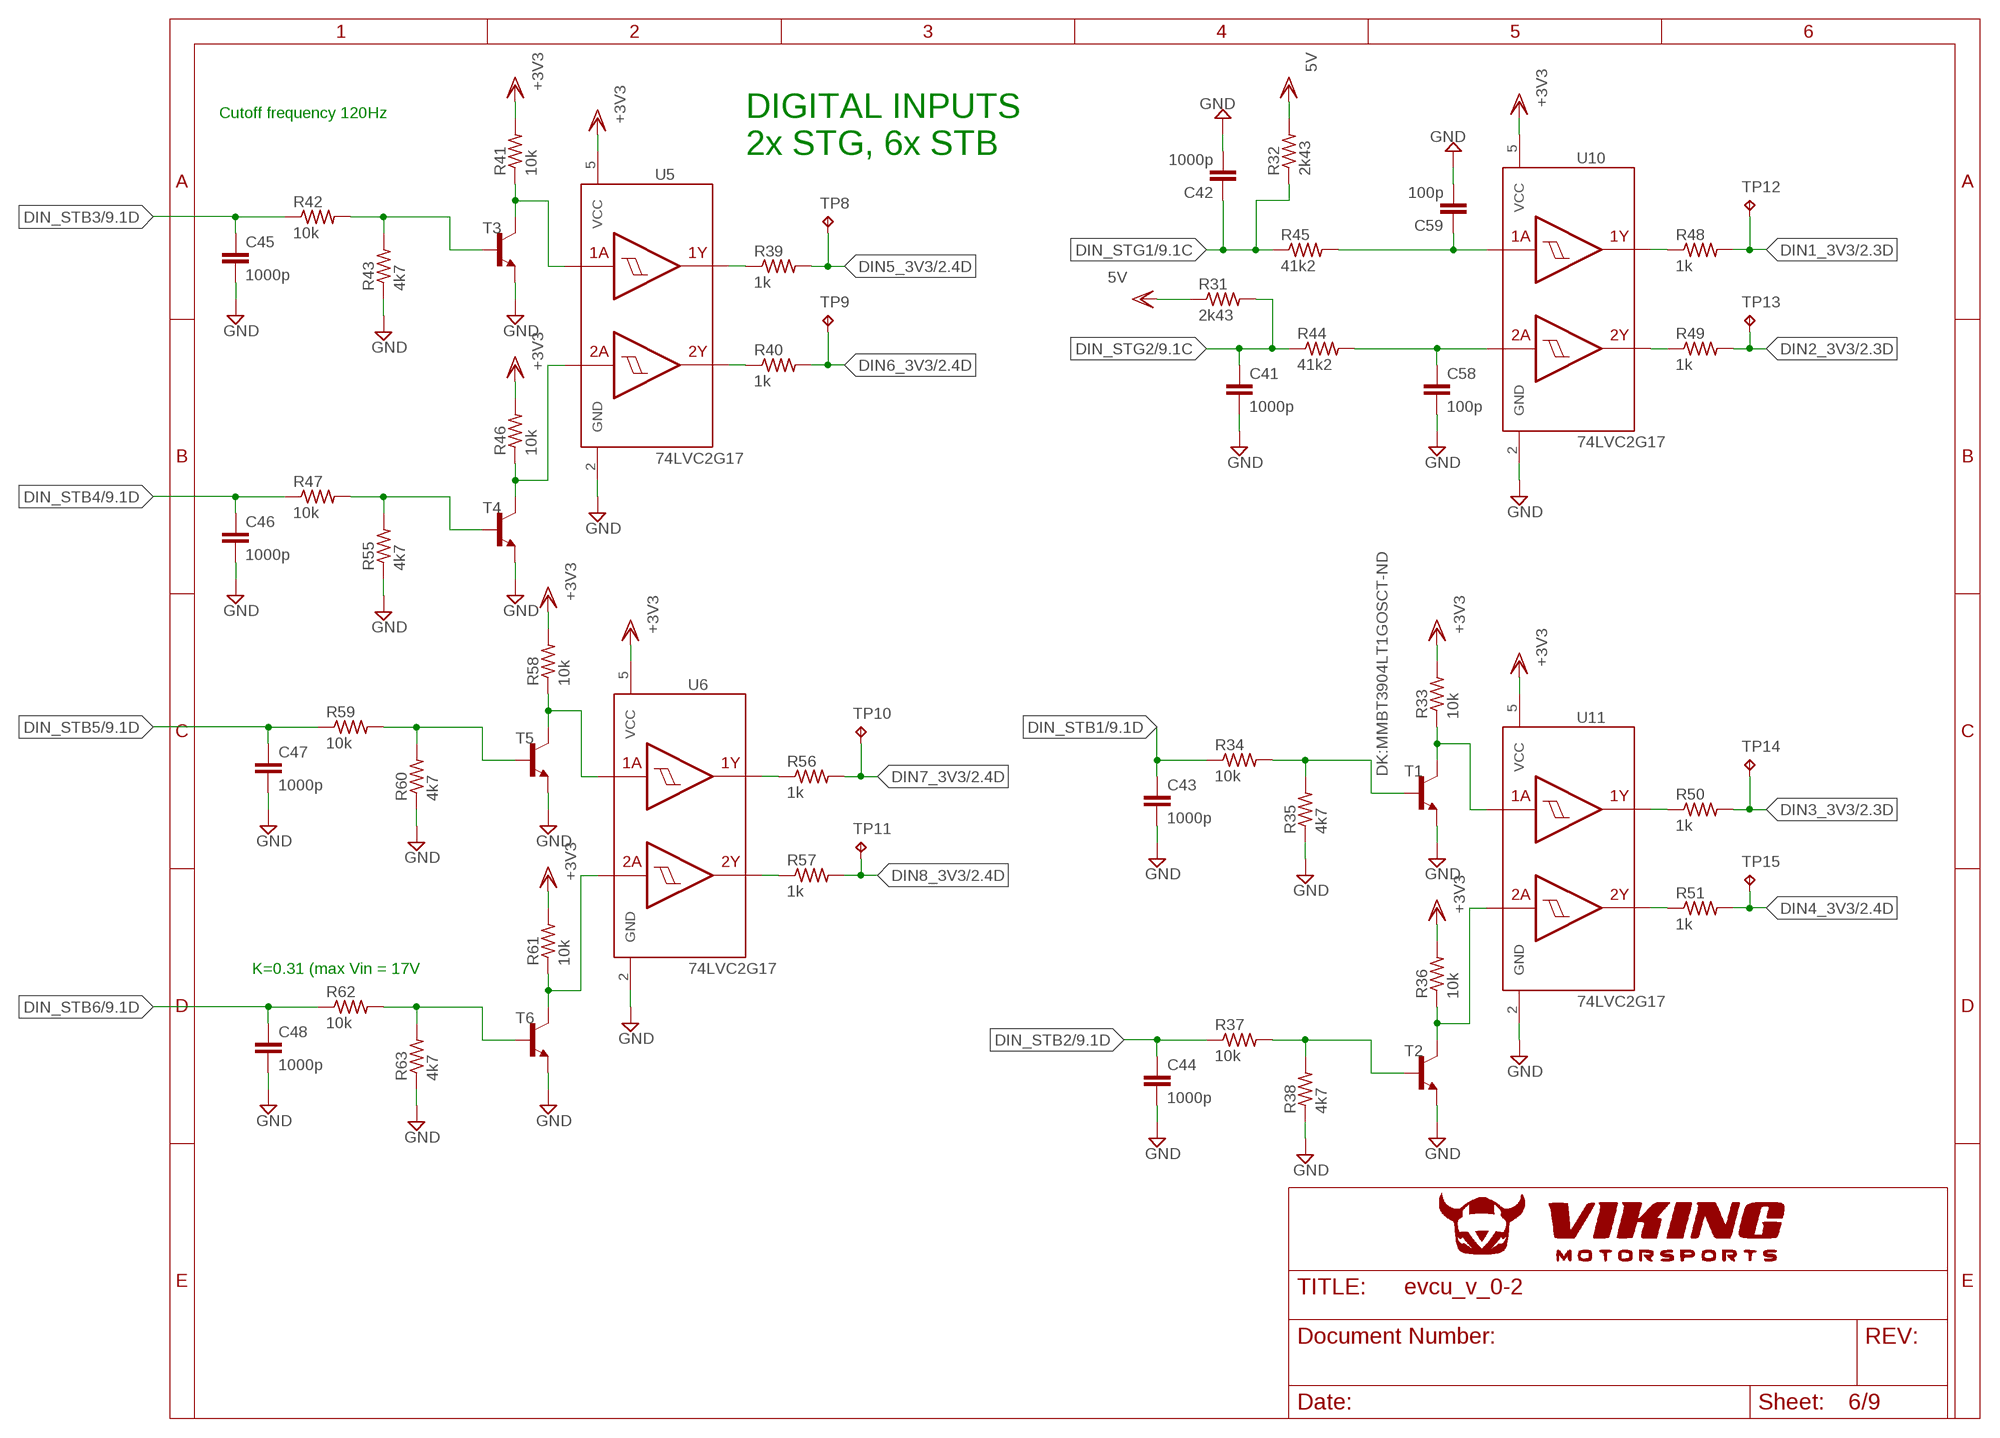
[diagram p5: schematic, sheet 6]

### Parts
C41  1000p  C-EUC0603  [C0603@1]
C42  1000p  C-EUC0603  [C0603@1]
C43  1000p  C-EUC0603  [C0603@1]
C44  1000p  C-EUC0603  [C0603@1]
C45  1000p  C-EUC0603  [C0603@1]
C46  1000p  C-EUC0603  [C0603@1]
C47  1000p  C-EUC0603  [C0603@1]
C48  1000p  C-EUC0603  [C0603@1]
C58  100p  C-EUC0603  [C0603@1]
C59  100p  C-EUC0603  [C0603@1]
R31  2k43  R-US_R0603  [R0603]
R32  2k43  R-US_R0603  [R0603]
R33  10k  R-US_R0603  [R0603]
R34  10k  R-US_R0603  [R0603]
R35  4k7  R-US_R0603  [R0603]
R36  10k  R-US_R0603  [R0603]
R37  10k  R-US_R0603  [R0603]
R38  4k7  R-US_R0603  [R0603]
R39  1k  R-US_R0603  [R0603]
R40  1k  R-US_R0603  [R0603]
R41  10k  R-US_R0603  [R0603]
R42  10k  R-US_R0603  [R0603]
R43  4k7  R-US_R0603  [R0603]
R44  41k2  R-US_R0603  [R0603]
R45  41k2  R-US_R0603  [R0603]
R46  10k  R-US_R0603  [R0603]
R47  10k  R-US_R0603  [R0603]
R48  1k  R-US_R0603  [R0603]
R49  1k  R-US_R0603  [R0603]
R50  1k  R-US_R0603  [R0603]
R51  1k  R-US_R0603  [R0603]
R55  4k7  R-US_R0603  [R0603]
R56  1k  R-US_R0603  [R0603]
R57  1k  R-US_R0603  [R0603]
R58  10k  R-US_R0603  [R0603]
R59  10k  R-US_R0603  [R0603]
R60  4k7  R-US_R0603  [R0603]
R61  10k  R-US_R0603  [R0603]
R62  10k  R-US_R0603  [R0603]
R63  4k7  R-US_R0603  [R0603]
T1  DK:MMBT3904LT1GOSCT-ND  MMBT3904LT1-NPN-SOT23-BEC  [SOT23-BEC]
T2  DK:MMBT3904LT1GOSCT-ND  MMBT3904LT1-NPN-SOT23-BEC  [SOT23-BEC]
T3  DK:MMBT3904LT1GOSCT-ND  MMBT3904LT1-NPN-SOT23-BEC  [SOT23-BEC]
T4  DK:MMBT3904LT1GOSCT-ND  MMBT3904LT1-NPN-SOT23-BEC  [SOT23-BEC]
T5  DK:MMBT3904LT1GOSCT-ND  MMBT3904LT1-NPN-SOT23-BEC  [SOT23-BEC]
T6  DK:MMBT3904LT1GOSCT-ND  MMBT3904LT1-NPN-SOT23-BEC  [SOT23-BEC]
TP8  TPB1,27  [B1,27]
TP9  TPB1,27  [B1,27]
TP10  TPB1,27  [B1,27]
TP11  TPB1,27  [B1,27]
TP12  TPB1,27  [B1,27]
TP13  TPB1,27  [B1,27]
TP14  TPB1,27  [B1,27]
TP15  TPB1,27  [B1,27]
U5  74LVC2G17  [SOT363_INFINEON]
U6  74LVC2G17  [SOT363_INFINEON]
U10  74LVC2G17  [SOT363_INFINEON]
U11  74LVC2G17  [SOT363_INFINEON]

### Nets
5V: R31.1 R32.2 ; also sheet 1,3,5,7,8,9
+3V3: R33.2 R36.2 R41.2 R46.2 R58.2 R61.2 U5.5(VCC) U6.5(VCC) U10.5(VCC) U11.5(VCC) ; also sheet 1,2,3,4,5
DIN1_3V3: R48.2 TP12.TP ; also sheet 2
DIN2_3V3: R49.2 TP13.TP ; also sheet 2
DIN3_3V3: R50.2 TP14.TP ; also sheet 2
DIN4_3V3: R51.2 TP15.TP ; also sheet 2
DIN5_3V3: R39.2 TP8.TP ; also sheet 2
DIN6_3V3: R40.2 TP9.TP ; also sheet 2
DIN7_3V3: R56.2 TP10.TP ; also sheet 2
DIN8_3V3: R57.2 TP11.TP ; also sheet 2
DIN_STB1: C43.1 R34.1 ; also sheet 9
DIN_STB2: C44.1 R37.1 ; also sheet 9
DIN_STB3: C45.1 R42.1 ; also sheet 9
DIN_STB4: C46.1 R47.1 ; also sheet 9
DIN_STB5: C47.1 R59.1 ; also sheet 9
DIN_STB6: C48.1 R62.1 ; also sheet 9
DIN_STG1: C42.1 R32.1 R45.1 ; also sheet 9
DIN_STG2: C41.1 R31.2 R44.1 ; also sheet 9
GND: C41.2 C42.2 C43.2 C44.2 C45.2 C46.2 C47.2 C48.2 C58.2 C59.2 R35.1 R38.1 R43.1 R55.1 R60.1 R63.1 T1.E T2.E T3.E T4.E T5.E T6.E U5.2(GND) U6.2(GND) U10.2(GND) U11.2(GND) ; also sheet 1,2,3,4,5,7,8,9
N$25: R33.1 T1.C U11.1(1A)
N$26: R36.1 T2.C U11.3(2A)
N$29: R39.1 U5.6(1Y)
N$31: R40.1 U5.4(2Y)
N$32: R41.1 T3.C U5.1(1A)
N$34: R46.1 T4.C U5.3(2A)
N$39: R56.1 U6.6(1Y)
N$40: R57.1 U6.4(2Y)
N$41: R58.1 T5.C U6.1(1A)
N$42: R61.1 T6.C U6.3(2A)
N$50: R49.1 U10.4(2Y)
N$56: R48.1 U10.6(1Y)
N$58: R50.1 U11.6(1Y)
N$59: R51.1 U11.4(2Y)
TVS1: C58.1 R44.2 U10.3(2A)
TVS2: C59.1 R45.2 U10.1(1A)
TVS3: R34.2 R35.2 T1.B
TVS4: R37.2 R38.2 T2.B
TVS5: R42.2 R43.2 T3.B
TVS6: R47.2 R55.2 T4.B
TVS7: R59.2 R60.2 T5.B
TVS8: R62.2 R63.2 T6.B

### Notes on the sheet
- DIGITAL INPUTS
  2x STG, 6x STB
- Cutoff frequency 120Hz
- K=0.31 (max Vin = 17V

## Sheet 7 of 9
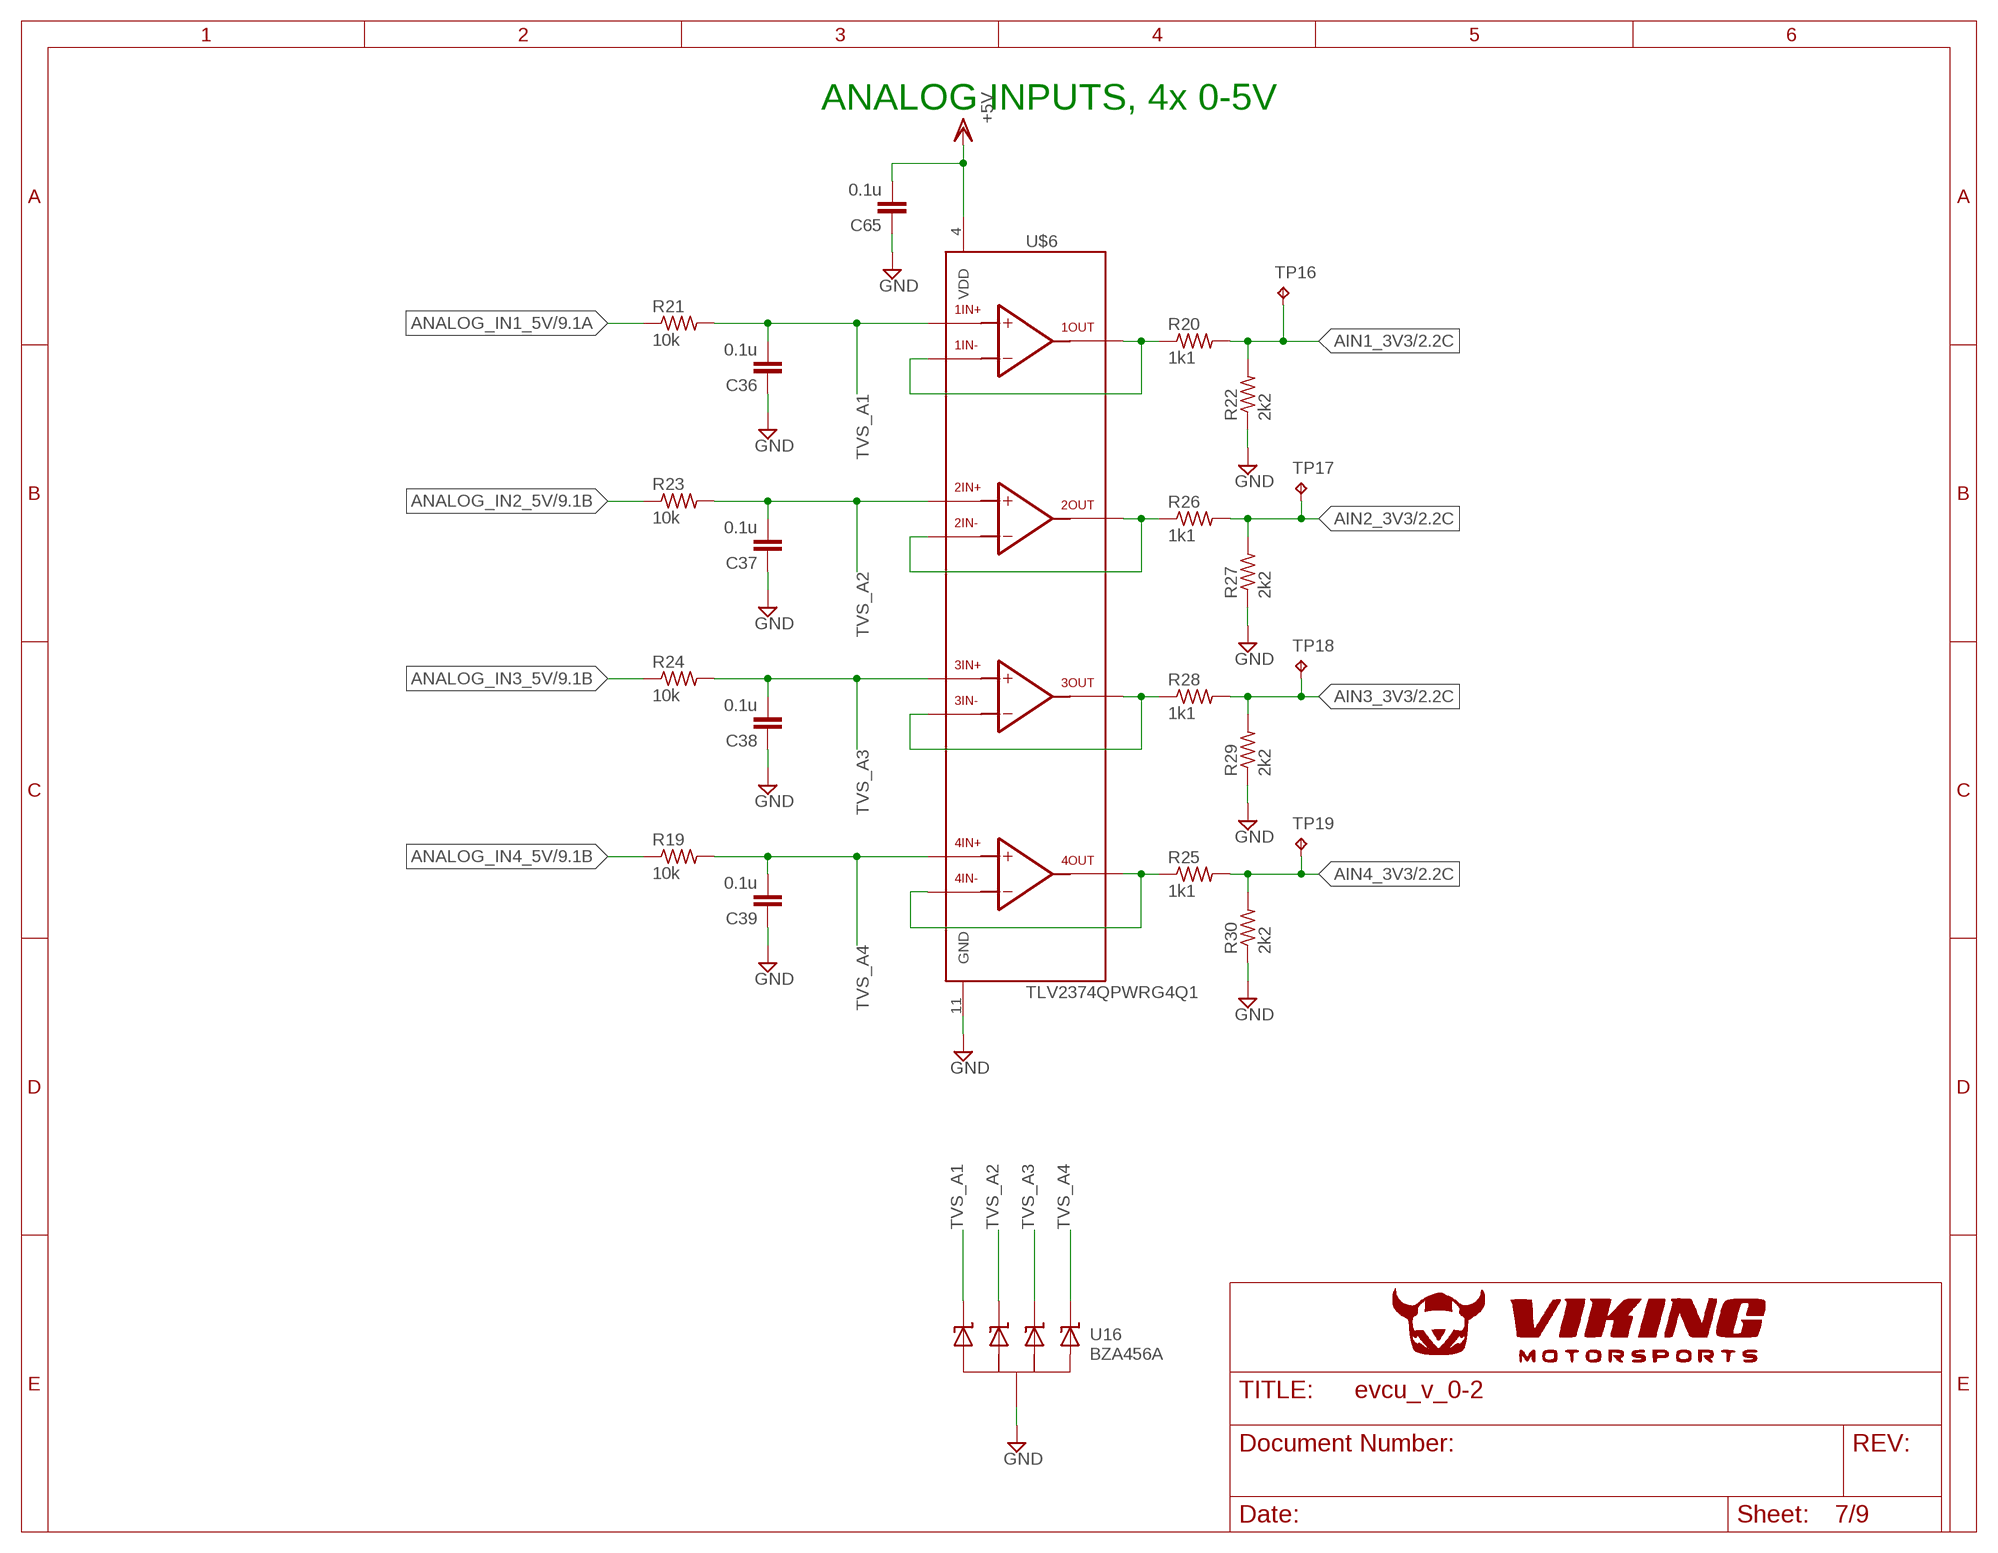
[diagram p6: schematic, sheet 7]

### Parts
C36  0.1u  C-EUC0603  [C0603@1]
C37  0.1u  C-EUC0603  [C0603@1]
C38  0.1u  C-EUC0603  [C0603@1]
C39  0.1u  C-EUC0603  [C0603@1]
C65  0.1u  C-EUC0603  [C0603@1]
R19  10k  R-US_R0603  [R0603]
R20  1k1  R-US_R0603  [R0603]
R21  10k  R-US_R0603  [R0603]
R22  2k2  R-US_R0603  [R0603]
R23  10k  R-US_R0603  [R0603]
R24  10k  R-US_R0603  [R0603]
R25  1k1  R-US_R0603  [R0603]
R26  1k1  R-US_R0603  [R0603]
R27  2k2  R-US_R0603  [R0603]
R28  1k1  R-US_R0603  [R0603]
R29  2k2  R-US_R0603  [R0603]
R30  2k2  R-US_R0603  [R0603]
TP16  TPB1,27  [B1,27]
TP17  TPB1,27  [B1,27]
TP18  TPB1,27  [B1,27]
TP19  TPB1,27  [B1,27]
U16  BZA456A  [SOT457R_PHILIPS]
U$6  TLV2374QPWRG4Q1  [TSSOP14]

### Nets
5V: C65.2 U$6.4(VDD) ; supply symbol labelled +5V ; also sheet 1,3,5,6,8,9
AIN1_3V3: R20.2 R22.2 TP16.TP ; also sheet 2
AIN2_3V3: R26.2 R27.2 TP17.TP ; also sheet 2
AIN3_3V3: R28.2 R29.2 TP18.TP ; also sheet 2
AIN4_3V3: R25.2 R30.2 TP19.TP ; also sheet 2
ANALOG_IN1_5V: R21.1 ; also sheet 9
ANALOG_IN2_5V: R23.1 ; also sheet 9
ANALOG_IN3_5V: R24.1 ; also sheet 9
ANALOG_IN4_5V: R19.1 ; also sheet 9
GND: C36.1 C37.1 C38.1 C39.1 C65.1 R22.1 R27.1 R29.1 R30.1 U16.2(COM) U16.5(COM) U$6.11(GND) ; also sheet 1,2,3,4,5,6,8,9
N$18: R25.1 U$6.13 U$6.14
N$22: R20.1 U$6.1 U$6.2
N$27: R26.1 U$6.6 U$6.7
N$28: R28.1 U$6.8 U$6.9
TVS_A1: C36.2 R21.2 U16.1(C1) U$6.3
TVS_A2: C37.2 R23.2 U16.3(C2) U$6.5
TVS_A3: C38.2 R24.2 U16.4(C3) U$6.10
TVS_A4: C39.2 R19.2 U16.6(C4) U$6.12

### Notes on the sheet
- ANALOG INPUTS, 4x 0-5V

## Sheet 8 of 9
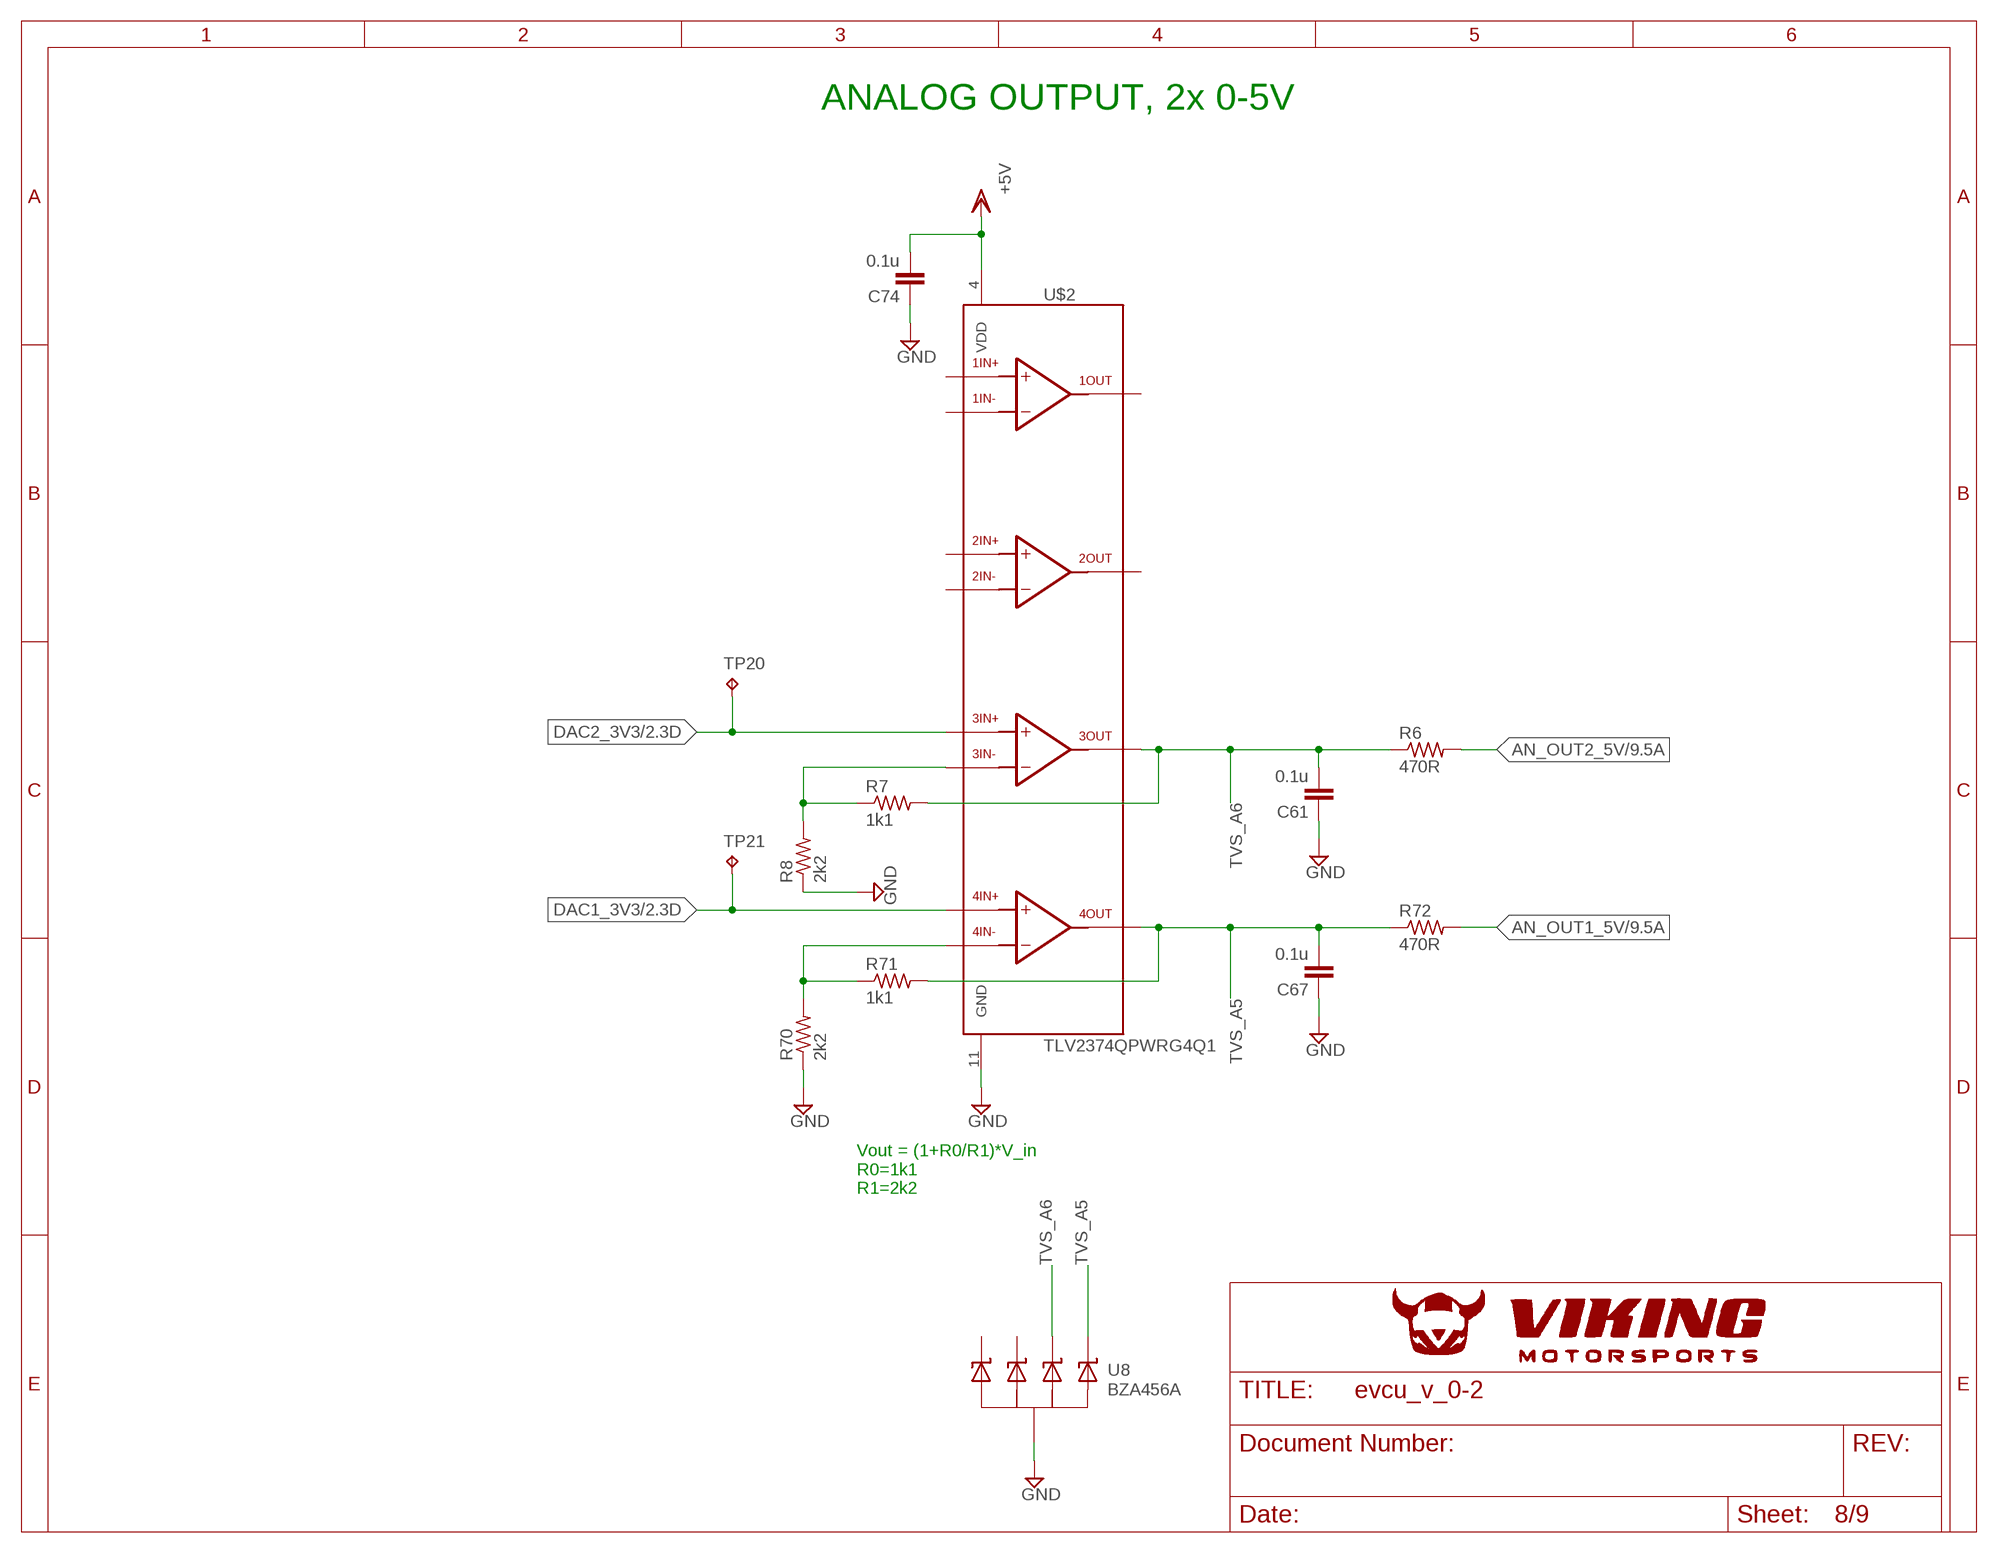
[diagram p7: schematic, sheet 8]

### Parts
C61  0.1u  C-EUC0603  [C0603@1]
C67  0.1u  C-EUC0603  [C0603@1]
C74  0.1u  C-EUC0603  [C0603@1]
R6  470R  R-US_R0603  [R0603]
R7  1k1  R-US_R0603  [R0603]
R8  2k2  R-US_R0603  [R0603]
R70  2k2  R-US_R0603  [R0603]
R71  1k1  R-US_R0603  [R0603]
R72  470R  R-US_R0603  [R0603]
TP20  TPB1,27  [B1,27]
TP21  TPB1,27  [B1,27]
U8  BZA456A  [SOT457R_PHILIPS]
U$2  TLV2374QPWRG4Q1  [TSSOP14]

### Nets
5V: C74.2 U$2.4(VDD) ; supply symbol labelled +5V ; also sheet 1,3,5,6,7,9
AN_OUT1_5V: R72.2 ; also sheet 9
AN_OUT2_5V: R6.2 ; also sheet 9
DAC1_3V3: TP21.TP U$2.12 ; also sheet 2
DAC2_3V3: TP20.TP U$2.10 ; also sheet 2
GND: C61.1 C67.1 C74.1 R8.1 R70.1 U8.2(COM) U8.5(COM) U$2.11(GND) ; also sheet 1,2,3,4,5,6,7,9
N$13: R7.1 R8.2 U$2.9
N$15: R70.2 R71.1 U$2.13
TVS_A5: C67.2 R71.2 R72.1 U8.6(C4) U$2.14
TVS_A6: C61.2 R6.1 R7.2 U8.4(C3) U$2.8
Unconnected: U8.1(C1) U8.3(C2) U$2.1 U$2.2 U$2.3 U$2.5 U$2.6 U$2.7

### Notes on the sheet
- ANALOG OUTPUT, 2x 0-5V
- Vout = (1+R0/R1)*V_in
  R0=1k1
  R1=2k2

## Sheet 9 of 9
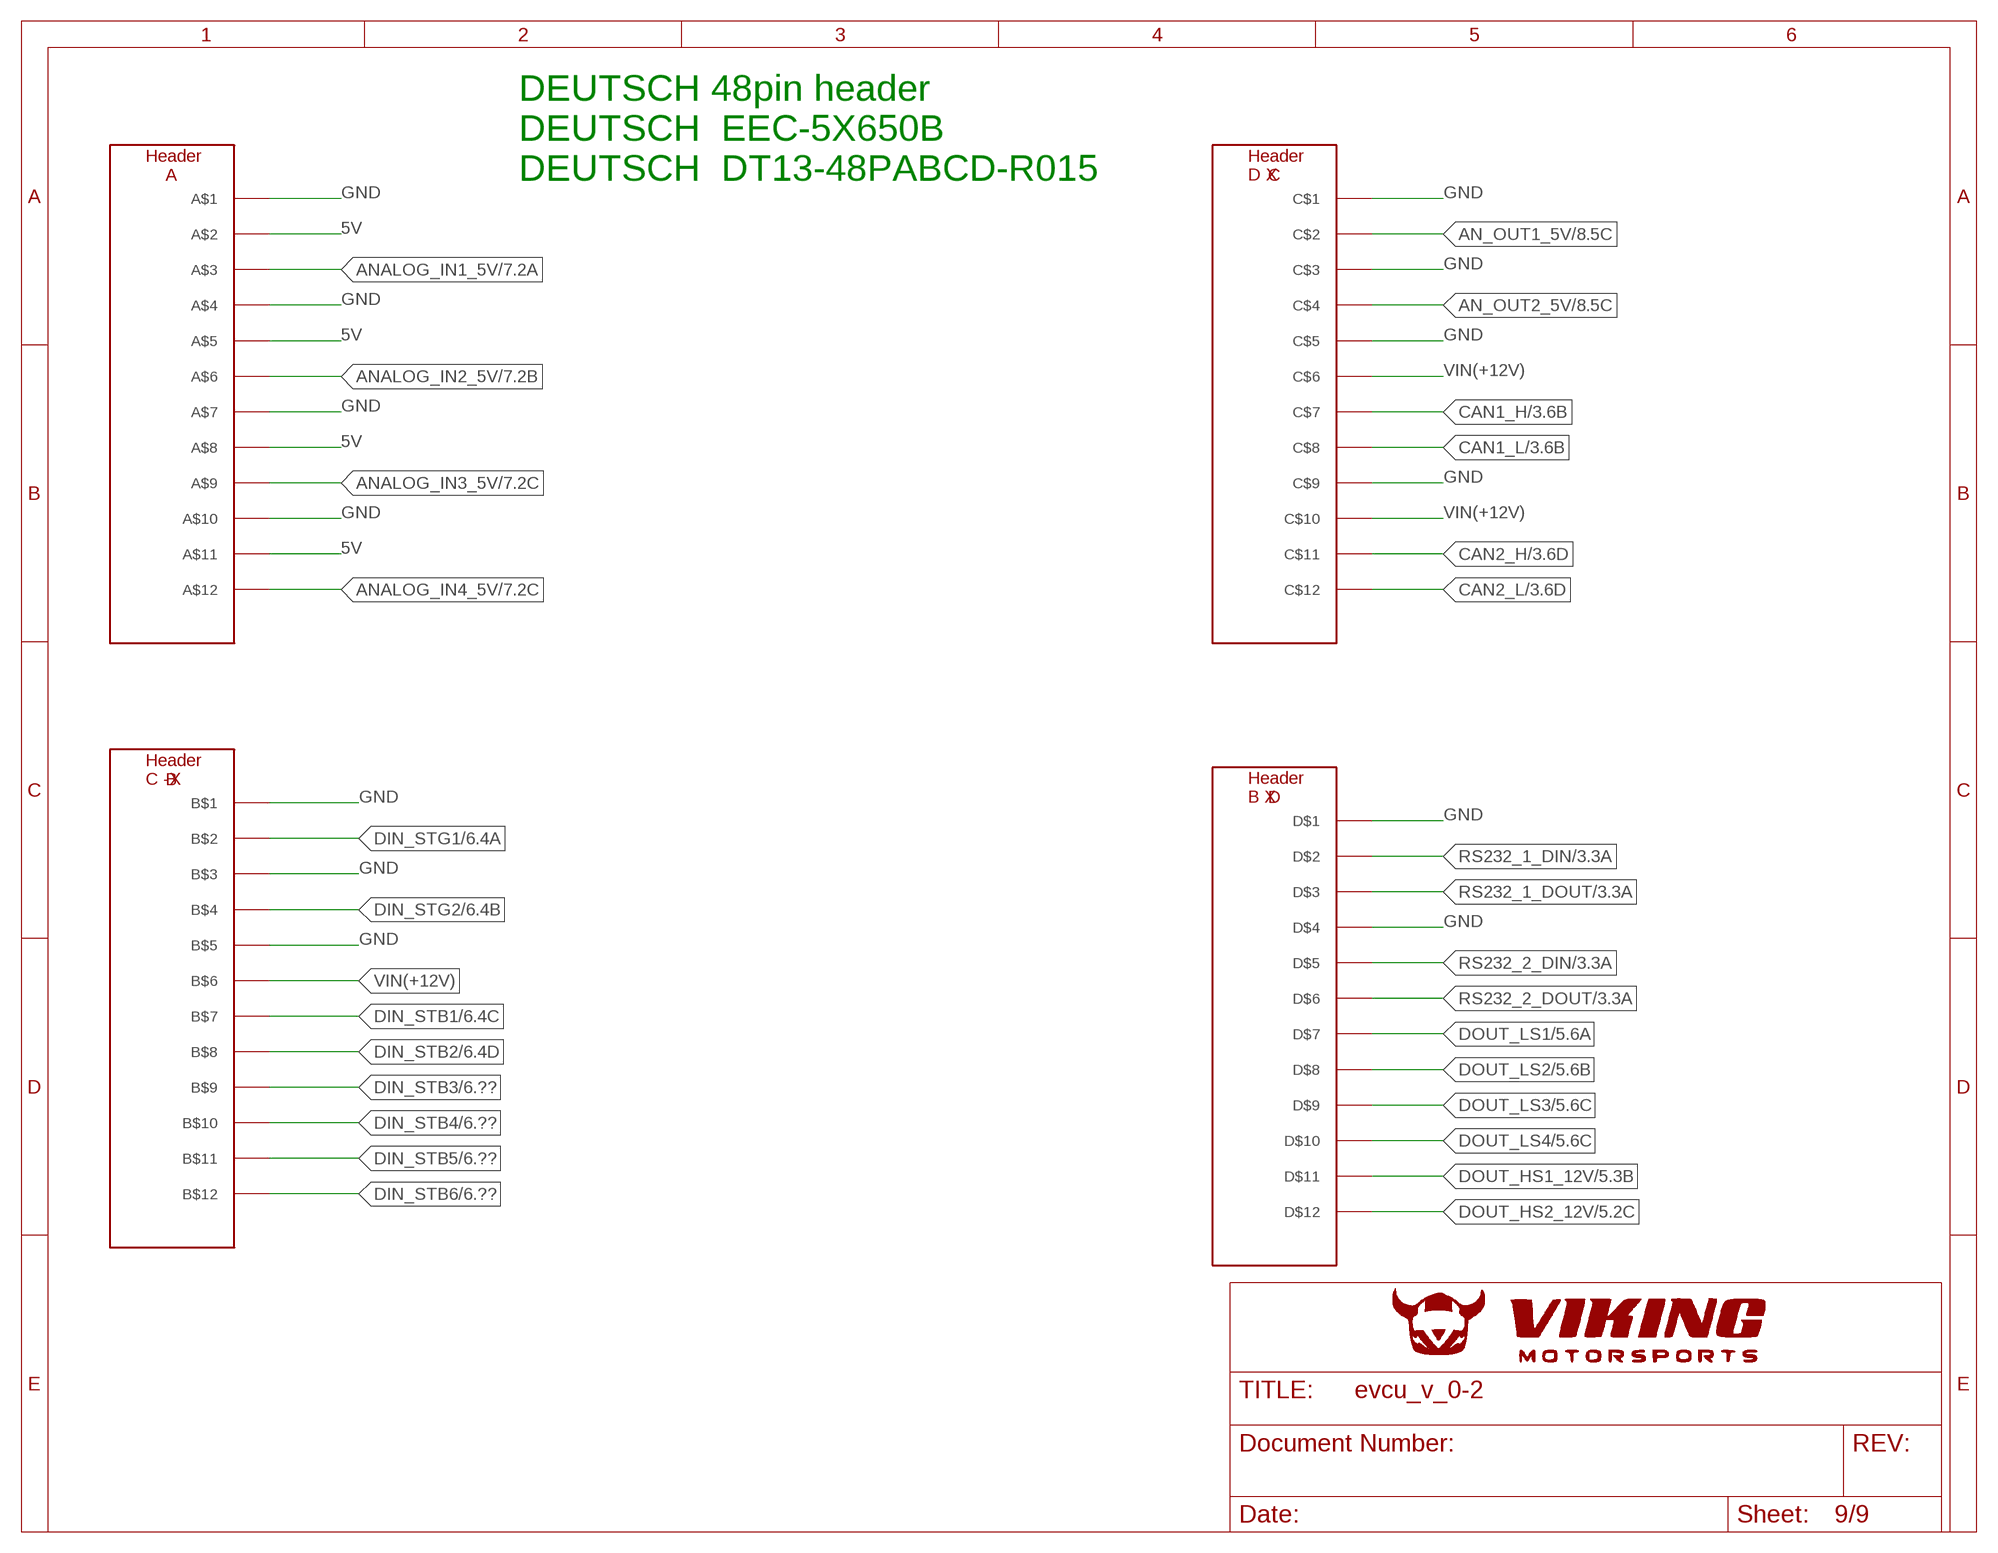
[diagram p8: schematic, sheet 9]

### Parts
U$5  DEUTSCH_48_PIN  [DEUTSCH_48_PIN]

### Nets
5V: U$5.A$2 U$5.A$5 U$5.A$8 U$5.A$11 ; also sheet 1,3,5,6,7,8
AN_OUT1_5V: U$5.C$2 ; also sheet 8
AN_OUT2_5V: U$5.C$4 ; also sheet 8
ANALOG_IN1_5V: U$5.A$3 ; also sheet 7
ANALOG_IN2_5V: U$5.A$6 ; also sheet 7
ANALOG_IN3_5V: U$5.A$9 ; also sheet 7
ANALOG_IN4_5V: U$5.A$12 ; also sheet 7
CAN1_H: U$5.C$7 ; also sheet 3
CAN1_L: U$5.C$8 ; also sheet 3
CAN2_H: U$5.C$11 ; also sheet 3
CAN2_L: U$5.C$12 ; also sheet 3
DIN_STB1: U$5.B$7 ; also sheet 6
DIN_STB2: U$5.B$8 ; also sheet 6
DIN_STB3: U$5.B$9 ; also sheet 6
DIN_STB4: U$5.B$10 ; also sheet 6
DIN_STB5: U$5.B$11 ; also sheet 6
DIN_STB6: U$5.B$12 ; also sheet 6
DIN_STG1: U$5.B$2 ; also sheet 6
DIN_STG2: U$5.B$4 ; also sheet 6
DOUT_HS1_12V: U$5.D$11 ; also sheet 5
DOUT_HS2_12V: U$5.D$12 ; also sheet 5
DOUT_LS1: U$5.D$7 ; also sheet 5
DOUT_LS2: U$5.D$8 ; also sheet 5
DOUT_LS3: U$5.D$9 ; also sheet 5
DOUT_LS4: U$5.D$10 ; also sheet 5
GND: U$5.A$1 U$5.A$4 U$5.A$7 U$5.A$10 U$5.B$1 U$5.B$3 U$5.B$5 U$5.C$1 U$5.C$3 U$5.C$5 U$5.C$9 U$5.D$1 U$5.D$4 ; also sheet 1,2,3,4,5,6,7,8
RS232_1_DIN: U$5.D$2 ; also sheet 3
RS232_1_DOUT: U$5.D$3 ; also sheet 3
RS232_2_DIN: U$5.D$5 ; also sheet 3
RS232_2_DOUT: U$5.D$6 ; also sheet 3
VIN(+12V): U$5.B$6 U$5.C$6 U$5.C$10 ; also sheet 1

### Notes on the sheet
- DEUTSCH 48pin header
  DEUTSCH  EEC-5X650B
  DEUTSCH  DT13-48PABCD-R015

## Power pins joined to a net without a drawn wire
VCCIO: IC3.4(VCCIO)

## Library data of the parts
B1 = qualified_MSD:COIN_CELL_6.8MM
C1-C25 C28-C30 C32 C33 C35-C59 C61-C71 C74 C75 = rcl:C-EU: CAPACITOR, European symbol
C26 C27 = resistor:C-US: CAPACITOR, American symbol
C31 = rcl:C-US: CAPACITOR, American symbol; PARTNO: CC0402KRX7R9BB471
C34 = rcl:C-US: CAPACITOR, American symbol; PARTNO: C0603C104K5RACTU
C60 C73 = pel_dipol_comp:CAPACITOR-POL; PARTNO: T491B226M016AT
C72 = rcl:C-US: CAPACITOR, American symbol; PARTNO: LMK105BJ104KV-F
D1 = diode:DIODE-: DIODE
D2 = qualified_1:LED; DM: 0; DR: 90.000; DX: 57.200; DY: 1.800; SHEETNO: 4
D3 D4 = diode:DIODE-: DIODE; PARTNO: RB160SS-40T2R
E_1 = Edison:EDISON_CONNECTOR_SEGMENTED
FB9 = qualified_1:FB
IC1 IC2 = texas:ISO1050: ISOLATED CAN TRANSCEIVER Source: http://focus.ti.com/lit/ds/symlink/iso1050.pdf; MPN: ISO1050DUBR; OC_FARNELL: 1755712; OC_NEWARK: 14R9899
IC3 = ftdichip:FT232R: Source: http://www.ftdichip.com/Documents/DataSheets/DS_FT232R_v104.pdf; MPN: FT232RL; OC_FARNELL: 1146032; OC_NEWARK: 91K9918
IC4 = 74xx-little-gum:74*1G126: Single Bus Buffer Gate With 3-State Outputs
IMU = joby_robotics:ASPIRIN; PARTNO: ASP6000
JP1-JP3 = SparkFun-Connectors:M06: Header 6 Standard 6-pin 0.1" header. Use with straight break away headers (SKU : PRT-00116), right angle break away headers (PRT-00553), swiss pins (PRT-00743), machine pins (PRT-00117), and female headers (PRT-00115). Molex polarized connector foot print use with SKU : PRT-08094 with associated crimp pins and housings. NOTES ON THE VARIANTS LOCK and LOCK_LONGPADS... This footprint was designed to help hold the alignment of a through-hole component (i.e. 6-pin header) while soldering it into place. You may notice that each hole has been shifted either up or down by 0.005 of an inch from it's more standard position (which is a perfectly straight line). This slight alteration caused the pins (the squares in the middle) to touch the edges of the holes. Because they are alternating, it causes a "brace" to hold the component in place. 0.005 has proven to be the perfect amount of "off-center" position when using our standard breakaway headers. Although looks a little odd when you look at the bare footprint, once you have a header in there, the alteration is very hard to notice. Also,if you push a header all the way into place, it is covered up entirely on the bottom side. This idea of altering the position of holes to aid alignment will be further integrated into the Sparkfun Library for other footprints. It can help hold any component with 3 or more connection pins.
JTAG = pel_misc:CONN_5-2; DNP: F; PARTNO: conn-smd-0.05in-5-2
L1 = res_cap:INDUCTOR
PTC1 = ptc-littlefuse:2920L
Q1 = crystal:CSM-7X-DU: SMD CRYSTAL Source: www.ecsxtal.com .. Crystal 3.6864MHz CSM_7X_DU.PDF; OC_FARNELL: unknown; OC_NEWARK: unknown
R1-R65 R70-R72 = resistor:R-US_: RESISTOR, American symbol
T1-T6 = transistor:*-NPN-: NPN Transistror BF959 corrected 2008.03.06
TG1-TG7 TP1-TP46 TP48-TP63 = testpad:TP: Test pad
TVS1 = diode:SUPPRESSOR-: Suppressor diode; PARTNO: SM30T35AY
U1 = logger:STM32F207VC: STM32F207VC
U2 = Texas Instruments_By_element14_Batch_1:TRS3232EQPWRQ1: RS-232 LINE DRIVER/RECEIVER; DIGIKEY: 296-24863-1-ND; MPN: TRS3232EQPWRQ1; OC_FARNELL: -; OC_NEWARK: 09R6724; PACKAGE: TSSOP-16; SUPPLIER: Texas Instruments
U3 U13 = vms:BTS3405G: Smart Low-Side Power Switch BTS3405G
U4 U12 = vms:ISP452: ISP 452 Smart Power High-Side-Switch for Industrial Applications
U5 U6 U10 U11 = modulator:74LVC2G17: 74LVC2G17 Dual non-inverting Schmitt trigger with 5 V tolerant input
U7 U17 U19 = _VMS:TXB0108: TXB0108PWR
U8 U16 = modulator:BZA456A: BZA456A
U9 U14 = SparkFun-Connectors:USD-SOCKET: microSD Socket Push-push type uSD socket. Schematic element and footprint production proven. Spark Fun Electronics SKU : PRT-00127. tDoc lines correctly indicate media card edge positions when inserting (unlocked, locked, depressed).
U$1 = _VMS:OKI-78SR-5/1.5-W36-C
U$2 U$6 = _VMS:TLV2374QPWRG4Q1
U$3 = _VMS:GPS_UBLOX
U$5 = _VMS:DEUTSCH_48_PIN
U$7 U$8 = _VMS:R1SE
U$9 = _VMS:OKI-78SR-3.3/1.5-W36-C
USB1-USB3 = usb_con-update:MOLEX-47346-0001: MICRO USB B, BOTTOM MOUNT
VREG1 = paparazzi:MIC5209; PARTNO: MIC5209-3.3YM

## Net classes
0 default: width 0.178 mm, drill 0.508 mm, clearance 0.178 mm